# EAGLE design main (EAGLE 9.5.1)

## Sheet 1 of 5
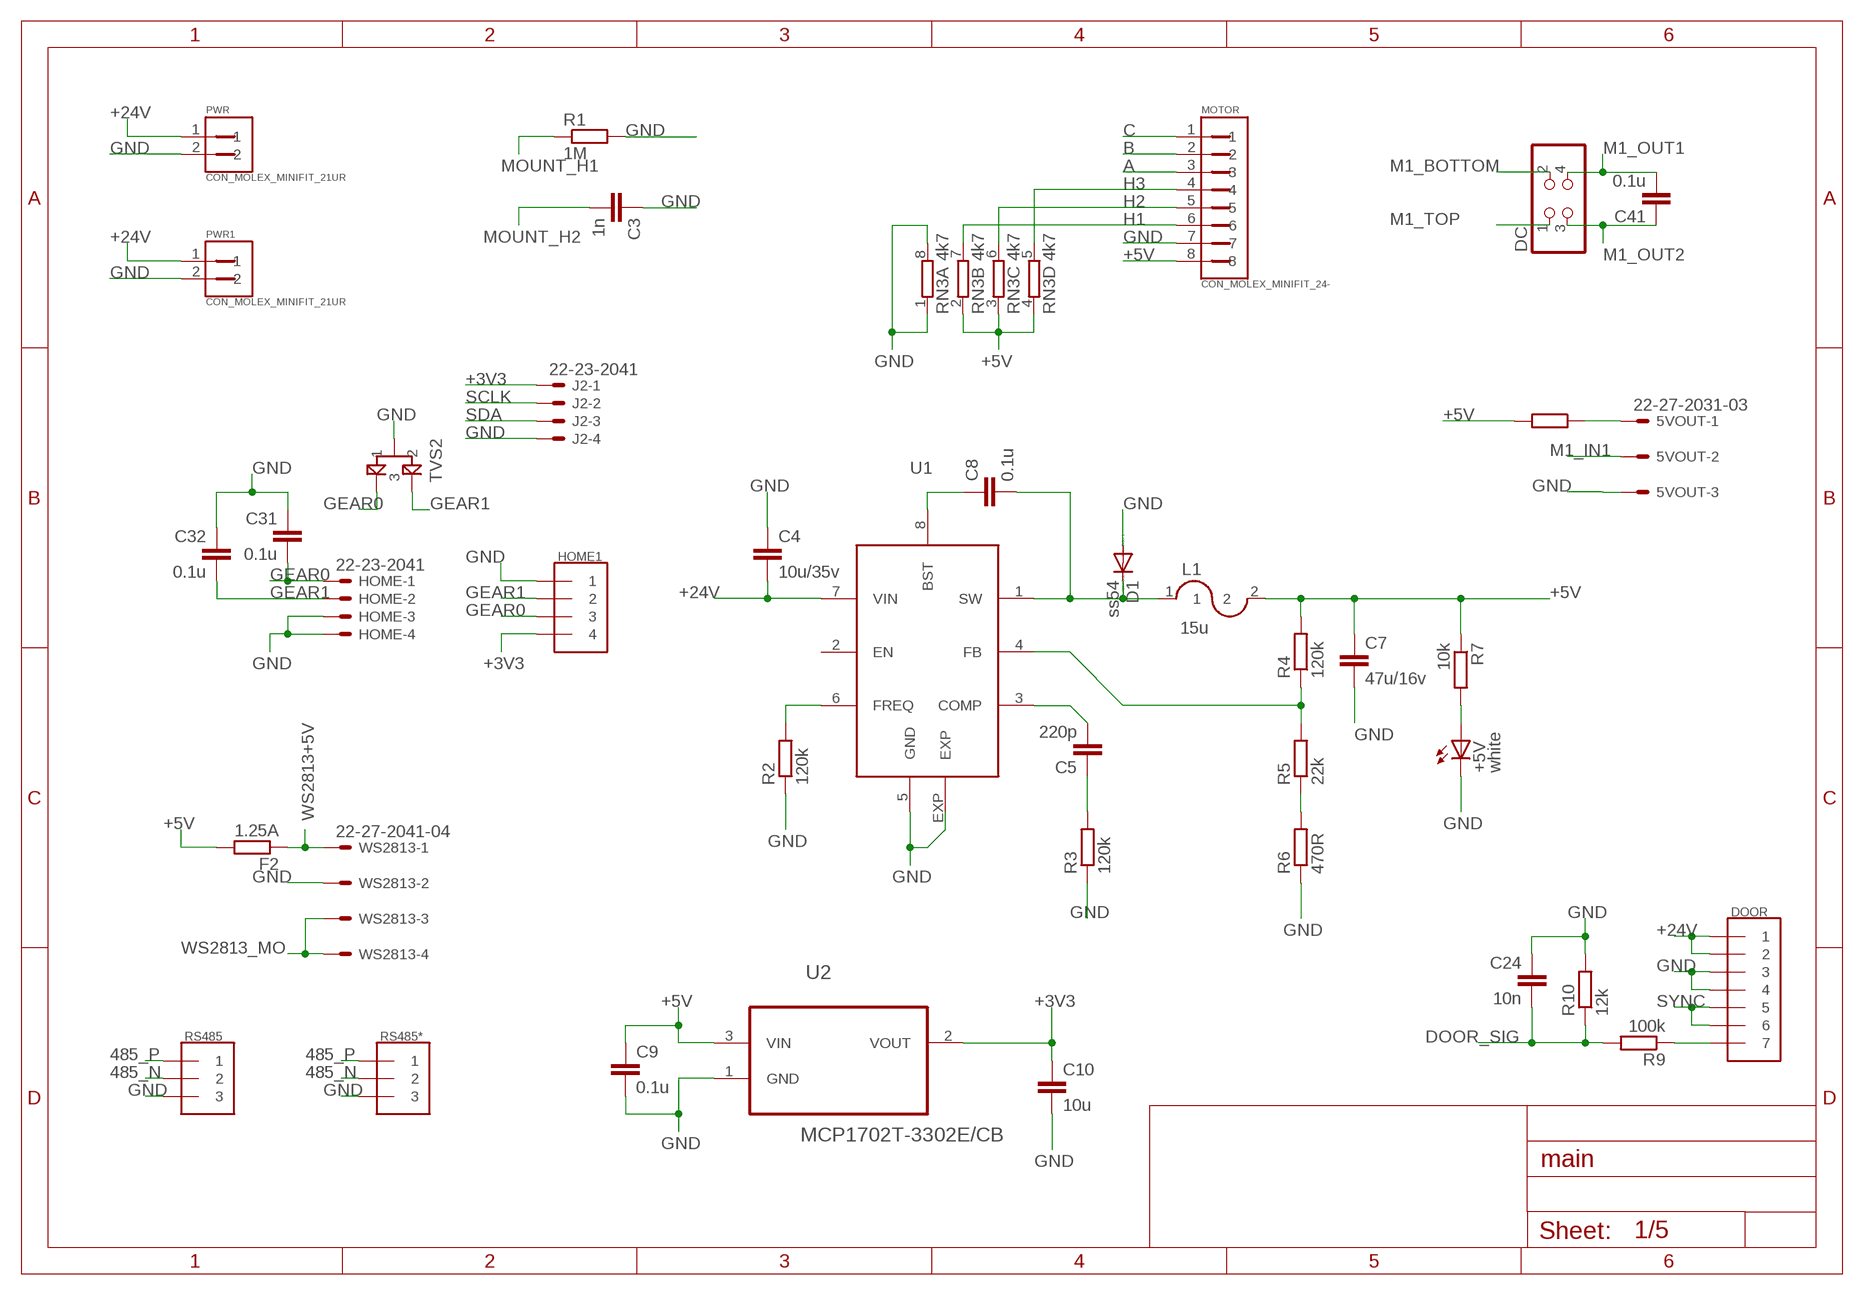
[diagram p0: schematic, sheet 1]

### Parts
5VOUT  22-27-2031-03  [6410-03]
+5V  white  LEDSML0603  [SML0603]
C3  1n  C-EUC0603  [C0603]
C4  10u/35v  C-EUC1206  [C1206]
C5  220p  C-EUC0603  [C0603]
C7  47u/16v  C-EUC1206  [C1206]
C8  0.1u  C-EUC0603  [C0603]
C9  0.1u  C-EUC0603  [C0603]
C10  10u  C-EUC0603  [C0603]
C24  10n  C-EUC0603  [C0603]
C31  0.1u  C-EUC0603  [C0603]
C32  0.1u  C-EUC0603  [C0603]
C41  0.1u  C-EUC0603  [C0603]
D1  ss54  DIODE-DO214BA  [DO214BA]
DC  430450414  [4304504-TH]
DOOR  1LINE_SOCKET_2MM_7  [1LINE_SOCKET_2MM_7]
F1  1.25A  R-EU_R1206  [R1206]
F2  1.25A  R-EU_R1206  [R1206]
HOME  22-23-2041  [22-23-2041]
HOME1  1LINE_SOCKET_2MM_4_90  [1LINE_SOCKET_2MM_4_90]
J2  22-23-2041  [22-23-2041]
L1  15u  RCL_L_CDRH8D38  [RCL_L_CDRH8D38]
MOTOR  CON_MOLEX_MINIFIT_24-  [CON_MOLEX_MINIFIT_2*4]
PWR  CON_MOLEX_MINIFIT_21UR  [CON_MOLEX_MINIFIT_2*1_UR]
PWR1  CON_MOLEX_MINIFIT_21UR  [CON_MOLEX_MINIFIT_2*1_UR]
R1  1M  R-EU_R0603  [R0603]
R2  120k  R-EU_R0603  [R0603]
R3  120k  R-EU_R0603  [R0603]
R4  120k  R-EU_R0603  [R0603]
R5  22k  R-EU_R0603  [R0603]
R6  470R  R-EU_R0603  [R0603]
R7  10k  R-EU_R0603  [R0603]
R9  100k  R-EU_R0603  [R0603]
R10  12k  R-EU_R0603  [R0603]
RN3  4k7  4R-NEXB38V  [EXB38V]
RS485  1LINE_SOCKET_2MM_3_90  [1LINE_SOCKET_2MM_3_90]
RS485*  1LINE_SOCKET_2MM_3_90  [1LINE_SOCKET_2MM_3_90]
TVS2  PESD33  GSOT05C-GS08  [RCL_SOT23]
U1  MP2560  [SOIC-8E]
U2  MCP1702T-3302E/CB  [SOT95P255X145-3N]
WS2813  22-27-2041-04  [6410-04]

### Nets
485_N: RS485*.P$2 RS485.P$2 ; also sheet 2,4
485_P: RS485*.P$1 RS485.P$1 ; also sheet 2,4
+3V3 [+3V3]: C10.1 HOME1.P$4 J2.1 U2.2(VOUT) ; also sheet 2,3
+5V: C7.1 C9.1 F1.2 F2.2 L1.2 MOTOR.8 R4.2 R7.1 RN3.2 RN3.3 RN3.4 U2.3(VIN)
+24V: C4.2 DOOR.P$1 DOOR.P$2 PWR1.1 PWR.1 U1.7(VIN) ; also sheet 3,5
A: MOTOR.3 ; also sheet 3
B: MOTOR.2 ; also sheet 3
C: MOTOR.1 ; also sheet 3
DOOR_SIG: C24.2 R9.2 R10.1 ; also sheet 2
GEAR0: C31.2 HOME1.P$3 HOME.1 TVS2.1 ; also sheet 2
GEAR1: C32.2 HOME1.P$2 HOME.2 TVS2.2 ; also sheet 2
GND: 5VOUT.3 +5V.C C3.1 C4.1 C7.2 C9.2 C10.2 C24.1 C31.1 C32.1 D1.A DOOR.P$3 DOOR.P$4 HOME1.P$1 HOME.3 HOME.4 J2.4 MOTOR.7 PWR1.2 PWR.2 R1.2 R2.1 R3.1 R6.1 R10.2 RN3.1 RN3.8 RS485*.P$3 RS485.P$3 TVS2.3 U1.5(GND) U1.EXP U2.1(GND) WS2813.2 ; also sheet 2,3,4,5
H1: MOTOR.6 RN3.7 ; also sheet 2
H2: MOTOR.5 RN3.6 ; also sheet 2
H3: MOTOR.4 RN3.5 ; also sheet 2
M1_BOTTOM: DC.2
M1_IN1: 5VOUT.2 ; also sheet 2,5
M1_OUT1: C41.2 DC.4 ; also sheet 5
M1_OUT2: C41.1 DC.3 ; also sheet 5
M1_TOP: DC.1
MOUNT_H1 [+24V]: R1.1
MOUNT_H2: C3.2
N$1: C8.2 D1.C L1.1 U1.1(SW)
N$2: 5VOUT.1 F1.1
N$3: C5.1 R3.2
N$4: R2.2 U1.6(FREQ)
N$5: C5.2 U1.3(COMP)
N$6: R5.1 R6.2
N$7: R4.1 R5.2 U1.4(FB)
N$8: C8.1 U1.8(BST)
N$9: +5V.A R7.2
SCLK: J2.2 ; also sheet 2
SDA: J2.3 ; also sheet 2
SIG-DOOR: DOOR.P$7 R9.1
SYNC: DOOR.P$5 DOOR.P$6
WS2813+5V: F2.1 WS2813.1 ; also sheet 2
WS2813_MO: WS2813.3 WS2813.4 ; also sheet 2
Unconnected: U1.2(EN)

## Sheet 2 of 5
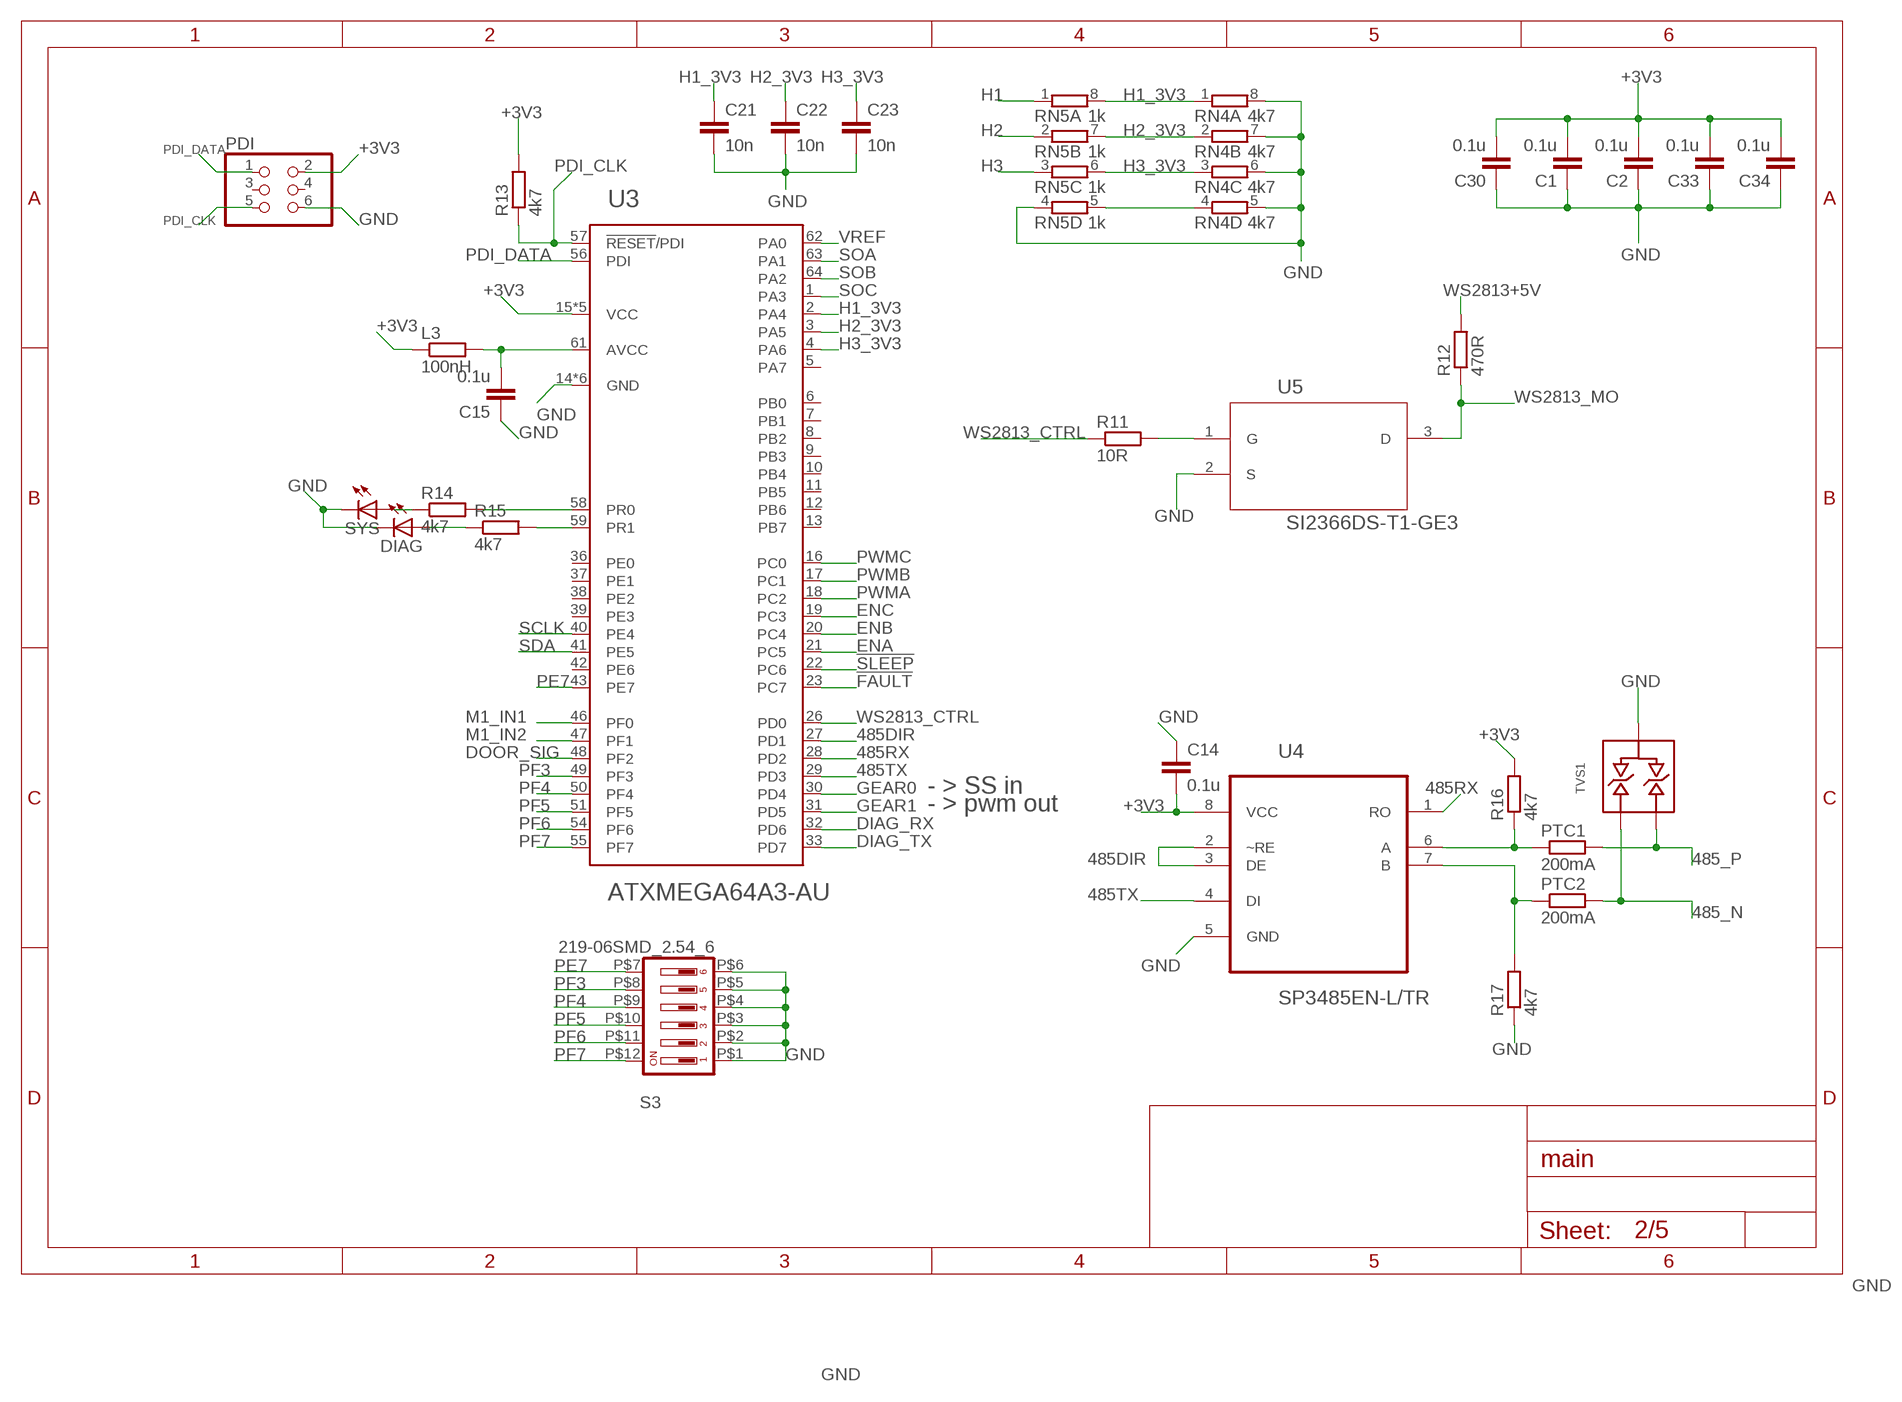
[diagram p1: schematic, sheet 2]

### Parts
C1  0.1u  C-EUC0603  [C0603]
C2  0.1u  C-EUC0603  [C0603]
C14  0.1u  C-EUC0603  [C0603]
C15  0.1u  C-EUC0603  [C0603]
C21  10n  C-EUC0603  [C0603]
C22  10n  C-EUC0603  [C0603]
C23  10n  C-EUC0603  [C0603]
C30  0.1u  C-EUC0603  [C0603]
C33  0.1u  C-EUC0603  [C0603]
C34  0.1u  C-EUC0603  [C0603]
DIAG  LEDSML0603  [SML0603]
L3  100nH  R-EU_R0603  [R0603]
PDI  PINHD-2X3  [2X03]
PTC1  200mA  R-EU_R0805  [R0805]
PTC2  200mA  R-EU_R0805  [R0805]
R11  10R  R-EU_R0603  [R0603]
R12  470R  R-EU_R0603  [R0603]
R13  4k7  R-EU_R0603  [R0603]
R14  4k7  R-EU_R0603  [R0603]
R15  4k7  R-EU_R0603  [R0603]
R16  4k7  R-EU_R0603  [R0603]
R17  4k7  R-EU_R0603  [R0603]
RN4  4k7  4R-NEXB38V  [EXB38V]
RN5  1k  4R-NEXB38V  [EXB38V]
S3  219-06SMD_2.54_6  [SMD-2.54-6]
SYS  LEDSML0603  [SML0603]
TVS1  SM712  [SOT23]
U3  ATXMEGA64A3-AU  [TQFP-64A-64]
U4  SP3485EN-L/TR  MAX3485CSA+  [SOIC127P600X175-8N]
U5  SI2366DS-T1-GE3  [SOT95P237X112-3N]

### Nets
485_N: PTC2.2 TVS1.P$1 ; also sheet 1,4
485_P: PTC1.2 TVS1.P$2 ; also sheet 1,4
485DIR: U3.27(PD1) U4.2(~RE) U4.3(DE)
485RX: U3.28(PD2) U4.1(RO)
485TX: U3.29(PD3) U4.4(DI)
!FAULT: U3.23(PC7) ; also sheet 3
!SLEEP: U3.22(PC6) ; also sheet 3
+3V3 [+3V3]: C1.2 C2.2 C14.2 C30.2 C33.2 C34.2 L3.1 PDI.2 R13.2 R16.2 U3.15(VCC) U3.25(VCC) U3.35(VCC) U3.45(VCC) U3.53(VCC) U4.8(VCC) ; also sheet 1,3
DIAG_RX: U3.32(PD6)
DIAG_TX: U3.33(PD7)
DOOR_SIG: U3.48(PF2) ; also sheet 1
ENA: U3.21(PC5) ; also sheet 3
ENB: U3.20(PC4) ; also sheet 3
ENC: U3.19(PC3) ; also sheet 3
GEAR0: U3.30(PD4) ; also sheet 1
GEAR1: U3.31(PD5) ; also sheet 1
GND: C1.1 C2.1 C14.1 C15.1 C21.2 C22.2 C23.2 C30.1 C33.1 C34.1 DIAG.C PDI.6 R17.1 RN4.4 RN4.5 RN4.6 RN4.7 RN4.8 RN5.4 RN5.5 S3.P$1 S3.P$2 S3.P$3 S3.P$4 S3.P$5 S3.P$6 SYS.C TVS1.P$3 U3.14(GND) U3.24(GND) U3.34(GND) U3.44(GND) U3.52(GND) U3.60(GND) U4.5(GND) U5.2(S) ; also sheet 1,3,4,5
H1: RN5.1 ; also sheet 1
H1_3V3: C21.1 RN4.1 RN5.8 U3.2(PA4)
H2: RN5.2 ; also sheet 1
H2_3V3: C22.1 RN4.2 RN5.7 U3.3(PA5)
H3: RN5.3 ; also sheet 1
H3_3V3: C23.1 RN4.3 RN5.6 U3.4(PA6)
M1_IN1: U3.46(PF0) ; also sheet 1,5
M1_IN2: U3.47(PF1) ; also sheet 5
N$10: PTC2.1 R17.2 U4.7(B)
N$17: PTC1.1 R16.1 U4.6(A)
N$19: C15.2 L3.2 U3.61(AVCC)
N$20: R14.2 U3.58(PR0)
N$21: R14.1 SYS.A
N$22: R15.2 U3.59(PR1)
N$23: DIAG.A R15.1
N$53: R11.2 U5.1(G)
PDI_CLK: PDI.5 R13.1 U3.57(!RESET!/PDI)
PDI_DATA: PDI.1 U3.56(PDI)
PE7: S3.P$7 U3.43(PE7)
PF3: S3.P$8 U3.49(PF3)
PF4: S3.P$9 U3.50(PF4)
PF5: S3.P$10 U3.51(PF5)
PF6: S3.P$11 U3.54(PF6)
PF7: S3.P$12 U3.55(PF7)
PWMA: U3.18(PC2) ; also sheet 3
PWMB: U3.17(PC1) ; also sheet 3
PWMC: U3.16(PC0) ; also sheet 3
SCLK: U3.40(PE4) ; also sheet 1
SDA: U3.41(PE5) ; also sheet 1
SOA: U3.63(PA1) ; also sheet 3
SOB: U3.64(PA2) ; also sheet 3
SOC: U3.1(PA3) ; also sheet 3
VREF: U3.62(PA0) ; also sheet 3
WS2813+5V: R12.2 ; also sheet 1
WS2813_CTRL: R11.1 U3.26(PD0)
WS2813_MO: R12.1 U5.3(D) ; also sheet 1
Unconnected: PDI.3 PDI.4 U3.5(PA7) U3.6(PB0) U3.7(PB1) U3.8(PB2) U3.9(PB3) U3.10(PB4) U3.11(PB5) U3.12(PB6) U3.13(PB7) U3.36(PE0) U3.37(PE1) U3.38(PE2) U3.39(PE3) U3.42(PE6)

### Notes on the sheet
- - > SS in
- - > pwm out

## Sheet 3 of 5
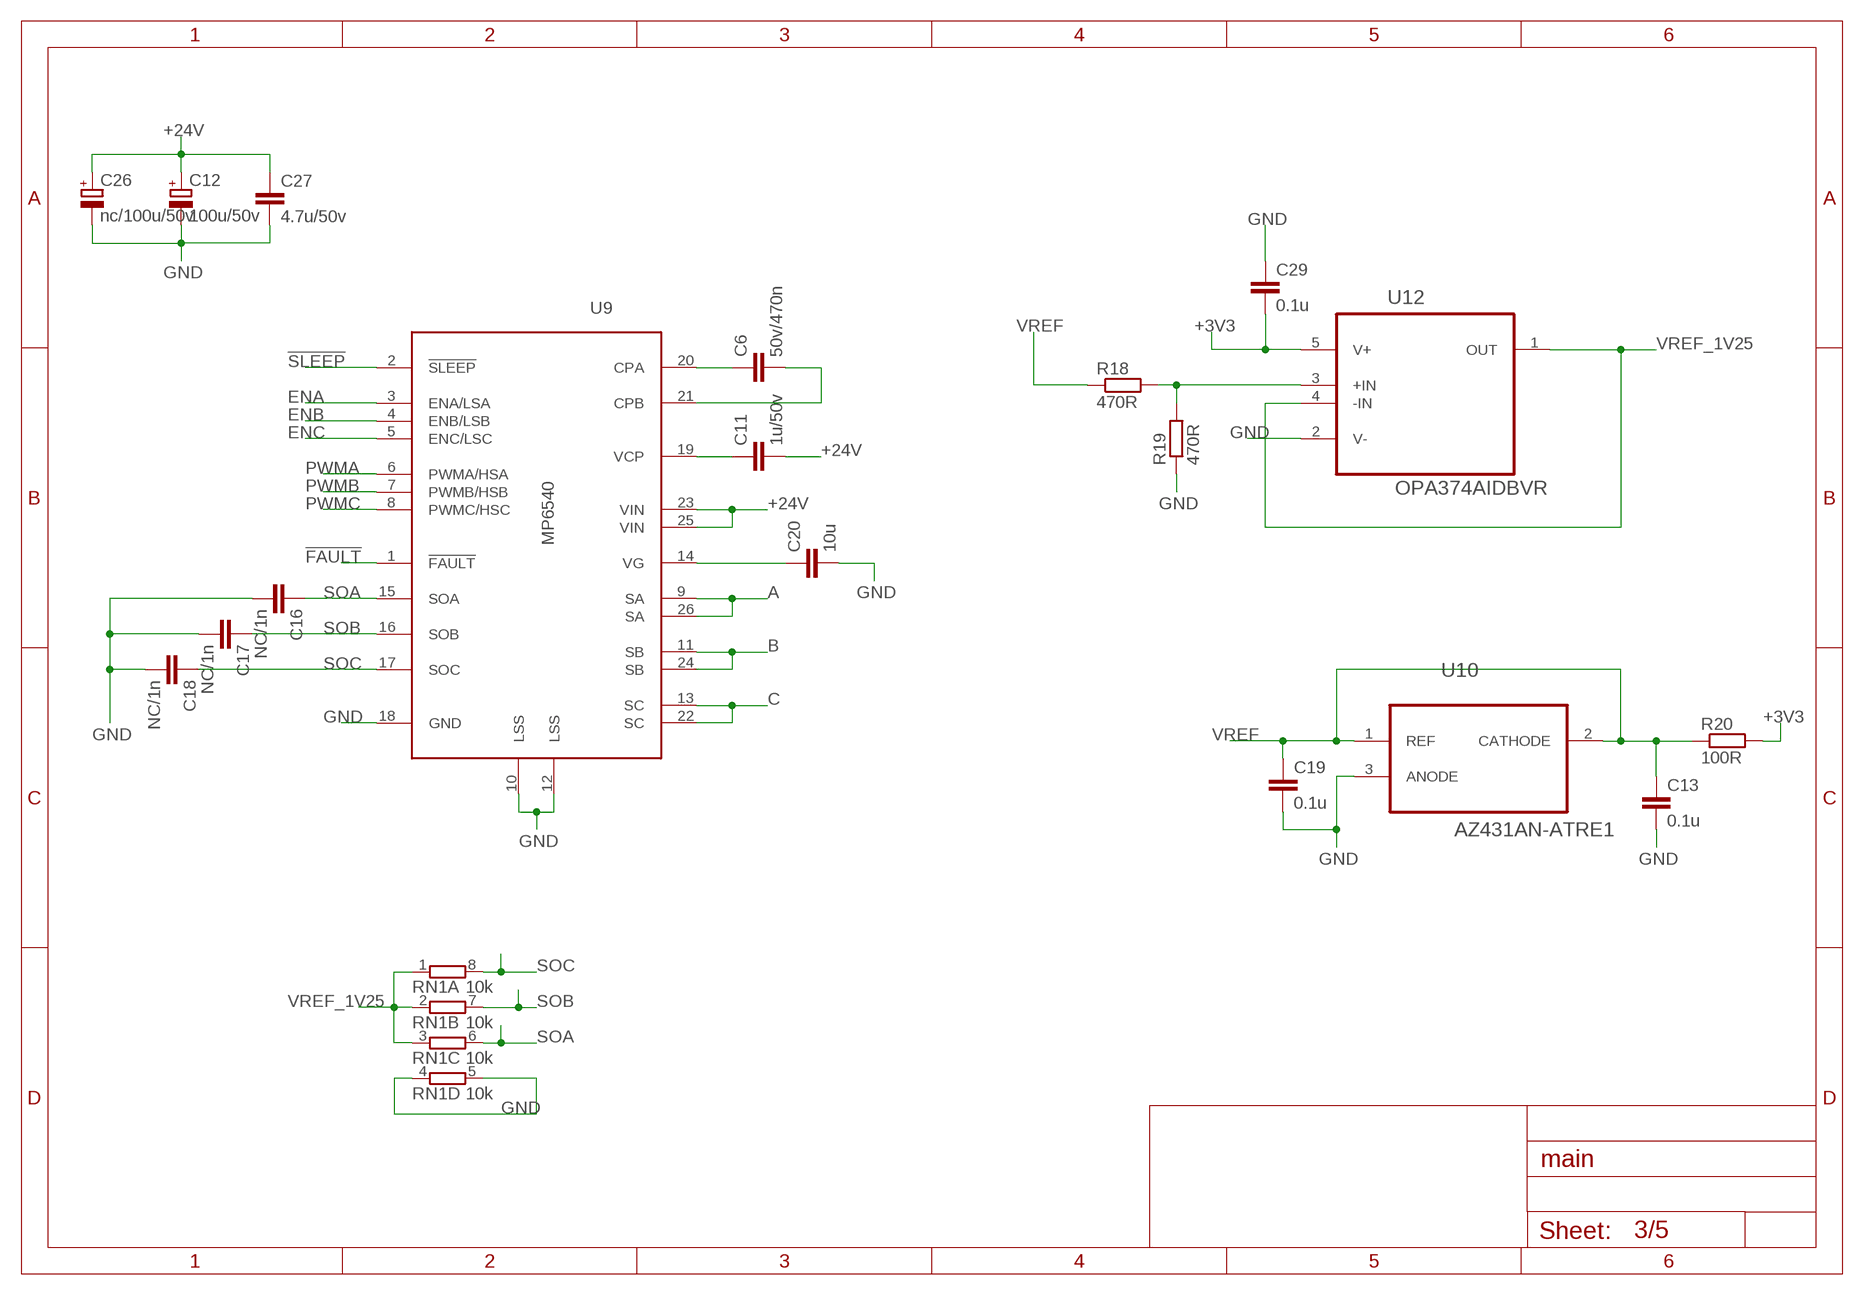
[diagram p2: schematic, sheet 3]

### Parts
C6  50v/470n  C-EUC0603  [C0603]
C11  1u/50v  C-EUC0805  [C0805]
C12  100u/50v  CPOL-EU140CLH-0810  [140CLH-0810]
C13  0.1u  C-EUC0603  [C0603]
C16  NC/1n  C-EUC0603  [C0603]
C17  NC/1n  C-EUC0603  [C0603]
C18  NC/1n  C-EUC0603  [C0603]
C19  0.1u  C-EUC0603  [C0603]
C20  10u  C-EUC0603  [C0603]
C26  nc/100u/50v  CPOL-EU140CLH-0810  [140CLH-0810]
C27  4.7u/50v  C-EUC0805  [C0805]
C29  0.1u  C-EUC0603  [C0603]
R18  470R  R-EU_R0603  [R0603]
R19  470R  R-EU_R0603  [R0603]
R20  100R  R-EU_R0603  [R0603]
RN1  10k  4R-NEXB38V  [EXB38V]
U9  MP6540  [QFN-26]
U10  AZ431AN-ATRE1  TL431BQDBZR  [SOT95P237X112-3N]
U12  OPA374AIDBVR  OPA378AIDBVT  [SOT95P280X145-5N]

### Nets
!FAULT: U9.1(!FAULT) ; also sheet 2
!SLEEP: U9.2(!SLEEP) ; also sheet 2
+3V3 [+3V3]: C29.2 R20.2 U12.5(V+) ; also sheet 1,2
+24V: C11.2 C12.+ C26.+ C27.1 U9.23(VIN) U9.25(VIN) ; also sheet 1,5
A: U9.9(SA) U9.26(SA) ; also sheet 1
B: U9.11(SB) U9.24(SB) ; also sheet 1
C: U9.13(SC) U9.22(SC) ; also sheet 1
ENA: U9.3(ENA/LSA) ; also sheet 2
ENB: U9.4(ENB/LSB) ; also sheet 2
ENC: U9.5(ENC/LSC) ; also sheet 2
GND: C12.- C13.2 C16.2 C17.2 C18.2 C19.2 C20.2 C26.- C27.2 C29.1 R19.1 RN1.4 RN1.5 U9.10(LSS) U9.12(LSS) U9.18(GND) U10.3(ANODE) U12.2(V-) ; also sheet 1,2,4,5
N$11: R18.2 R19.2 U12.3(+IN)
N$12: C6.1 U9.20(CPA)
N$13: C6.2 U9.21(CPB)
N$14: C11.1 U9.19(VCP)
N$15: C20.1 U9.14(VG)
PWMA: U9.6(PWMA/HSA) ; also sheet 2
PWMB: U9.7(PWMB/HSB) ; also sheet 2
PWMC: U9.8(PWMC/HSC) ; also sheet 2
SOA: C16.1 RN1.6 U9.15(SOA) ; also sheet 2
SOB: C17.1 RN1.7 U9.16(SOB) ; also sheet 2
SOC: C18.1 RN1.8 U9.17(SOC) ; also sheet 2
VREF: C13.1 C19.1 R18.1 R20.1 U10.1(REF) U10.2(CATHODE) ; also sheet 2
VREF_1V25: RN1.1 RN1.2 RN1.3 U12.1(OUT) U12.4(-IN)

## Sheet 4 of 5
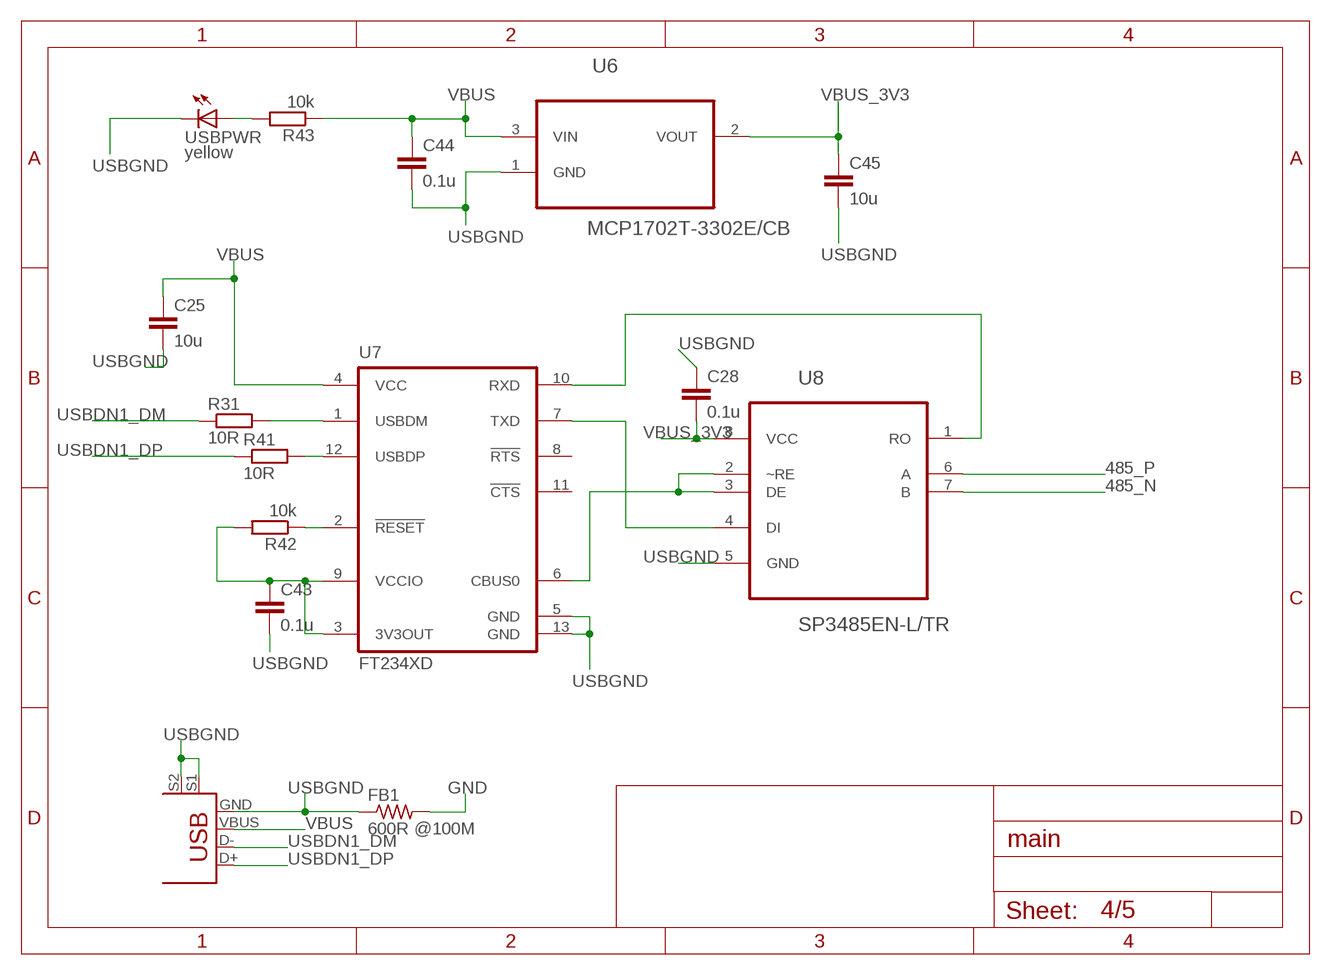
[diagram p3: schematic, sheet 4]

### Parts
C25  10u  C-EUC0603  [C0603]
C28  0.1u  C-EUC0603  [C0603]
C43  0.1u  C-EUC0603  [C0603]
C44  0.1u  C-EUC0603  [C0603]
C45  10u  C-EUC0603  [C0603]
FB1  600R @100M  R-US_R0805  [R0805]
R31  10R  R-EU_R0603  [R0603]
R41  10R  R-EU_R0603  [R0603]
R42  10k  R-EU_R0603  [R0603]
R43  10k  R-EU_R0603  [R0603]
U6  MCP1702T-3302E/CB  [SOT95P255X145-3N]
U7  FT234XD  [DFN12]
U8  SP3485EN-L/TR  MAX3485CSA+  [SOIC127P600X175-8N]
USBPWR  yellow  LEDSML0603  [SML0603]
USBUP  USB+SHIELD  [USB-B-PTH]

### Nets
485_N: U8.7(B) ; also sheet 1,2
485_P: U8.6(A) ; also sheet 1,2
GND: FB1.2 ; also sheet 1,2,3,5
N$39: R31.2 U7.1(USBDM)
N$60: R41.2 U7.12(USBDP)
N$63: C43.1 R42.2 U7.3(3V3OUT) U7.9(VCCIO)
N$64: R42.1 U7.2(!RESET!)
N$65: U7.7(TXD) U8.4(DI)
N$66: U7.10(RXD) U8.1(RO)
N$67: U7.6(CBUS0) U8.2(~RE) U8.3(DE)
N$68: R43.2 USBPWR.A
USBDN1_DM: R31.1 USBUP.D-
USBDN1_DP: R41.1 USBUP.D+
USBGND: C25.2 C28.1 C43.2 C44.2 C45.2 FB1.1 U6.1(GND) U7.5(GND) U7.13(GND) U8.5(GND) USBPWR.C USBUP.GND USBUP.S1 USBUP.S2
VBUS: C25.1 C44.1 R43.1 U6.3(VIN) U7.4(VCC) USBUP.VBUS
VBUS_3V3 [+3V3]: C28.2 C45.1 U6.2(VOUT) U8.8(VCC)
Unconnected: U7.8(!RTS!) U7.11(!CTS!)

## Sheet 5 of 5
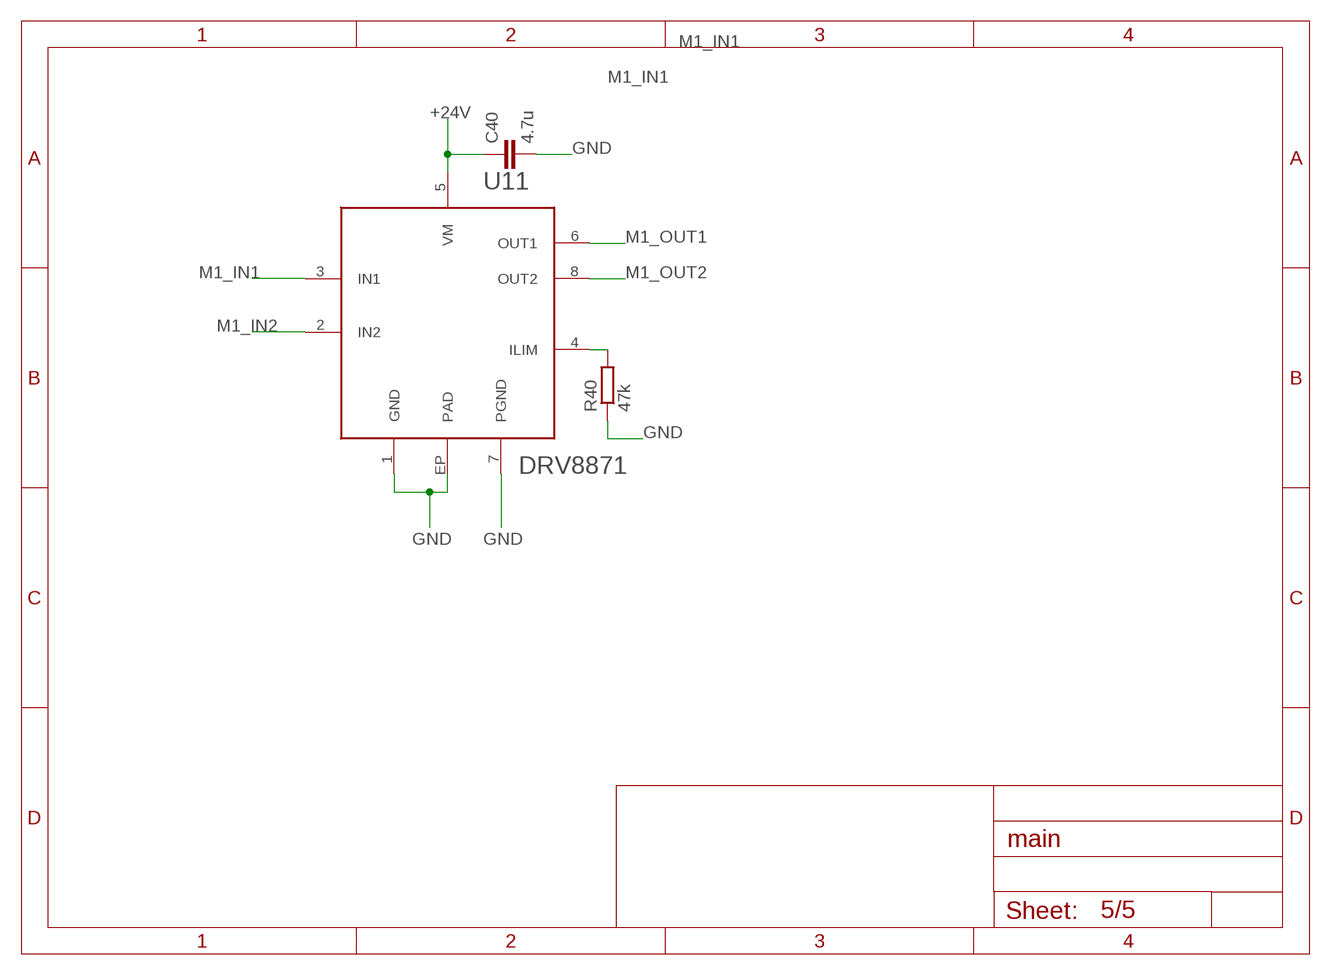
[diagram p4: schematic, sheet 5]

### Parts
C40  4.7u  C-EUC0805  [C0805]
R40  47k  R-EU_R0603  [R0603]
U11  DRV8871  [8HSOIC]

### Nets
+24V: C40.1 U11.5(VM) ; also sheet 1,3
GND: C40.2 R40.1 U11.1(GND) U11.7(PGND) U11.EP(PAD) ; also sheet 1,2,3,4
M1_IN1: U11.3(IN1) ; also sheet 1,2
M1_IN2: U11.2(IN2) ; also sheet 2
M1_OUT1: U11.6(OUT1) ; also sheet 1
M1_OUT2: U11.8(OUT2) ; also sheet 1
N$62: R40.2 U11.4(ILIM)

## Library data of the parts
5VOUT = con-molex:22-?-03: CONNECTOR wire to board 2.54 mm (.1 inch) pitch header; OC_FARNELL: unknown; OC_NEWARK: unknown
+5V DIAG SYS USBPWR = led:LED: LED OSRAM: - CHIPLED LG R971, LG N971, LY N971, LG Q971, LY Q971, LO R971, LY R971 LH N974, LH R974 LS Q976, LO Q976, LY Q976 LO Q996 - Hyper CHIPLED LW Q18S LB Q993, LB Q99A, LB R99A - SideLED LS A670, LO A670, LY A670, LG A670, LP A670 LB A673, LV A673, LT A673, LW A673 LH A674 LY A675 LS A676, LA A676, LO A676, LY A676, LW A676 LS A679, LY A679, LG A679 - Hyper Micro SIDELED® LS Y876, LA Y876, LO Y876, LY Y876 LT Y87S - SmartLED LW L88C, LW L88S LB L89C, LB L89S, LG L890 LS L89K, LO L89K, LY L89K LS L896, LA L896, LO L896, LY L896 - TOPLED LS T670, LO T670, LY T670, LG T670, LP T670 LSG T670, LSP T670, LSY T670, LOP T670, LYG T670 LG T671, LOG T671, LSG T671 LB T673, LV T673, LT T673, LW T673 LH T674 LS T676, LA T676, LO T676, LY T676, LB T676, LH T676, LSB T676, LW T676 LB T67C, LV T67C, LT T67C, LS T67K, LO T67K, LY T67K, LW E67C LS E67B, LA E67B, LO E67B, LY E67B, LB E67C, LV E67C, LT E67C LW T67C LS T679, LY T679, LG T679 LS T770, LO T770, LY T770, LG T770, LP T770 LB T773, LV T773, LT T773, LW T773 LH T774 LS E675, LA E675, LY E675, LS T675 LS T776, LA T776, LO T776, LY T776, LB T776 LHGB T686 LT T68C, LB T68C - Hyper Mini TOPLED® LB M676 - Mini TOPLED Santana® LG M470 LS M47K, LO M47K, LY M47K Source: http://www.osram.convergy.de LUXEON: - LUMILED® LXK2-PW12-R00, LXK2-PW12-S00, LXK2-PW14-U00, LXK2-PW14-V00 LXK2-PM12-R00, LXK2-PM12-S00, LXK2-PM14-U00 LXK2-PE12-Q00, LXK2-PE12-R00, LXK2-PE12-S00, LXK2-PE14-T00, LXK2-PE14-U00 LXK2-PB12-K00, LXK2-PB12-L00, LXK2-PB12-M00, LXK2-PB14-N00, LXK2-PB14-P00, LXK2-PB14-Q00 LXK2-PR12-L00, LXK2-PR12-M00, LXK2-PR14-Q00, LXK2-PR14-R00 LXK2-PD12-Q00, LXK2-PD12-R00, LXK2-PD12-S00 LXK2-PH12-R00, LXK2-PH12-S00 LXK2-PL12-P00, LXK2-PL12-Q00, LXK2-PL12-R00 Source: www.luxeon.com KINGBRIGHT: KA-3528ASYC Source: www.kingbright.com
C1-C11 C13-C25 C27-C34 C40 C41 C43-C45 = rcl:C-EU: CAPACITOR, European symbol
C12 C26 = rcl:CPOL-EU: POLARIZED CAPACITOR, European symbol
D1 = diode:DIODE-: DIODE
DC = con-molex-43045:4304504: 4-pin Male Molex Connector Temp range -40 to 105 C Current rating 5A per conductor Voltage rating 250V
DOOR = my_con:1LINE_SOCKET_2MM_7
F1 F2 L3 PTC1 PTC2 R1-R7 R9-R20 R31 R40-R43 = rcl:R-EU_: RESISTOR, European symbol
FB1 = rcl:R-US_: RESISTOR, American symbol
HOME J2 = con-molex:22-23-2041: .100" (2.54mm) Center Header - 4 Pin; MF: MOLEX; MPN: 22-23-2041; OC_FARNELL: 1462920; OC_NEWARK: 38C0355
HOME1 = my_con:1LINE_SOCKET_2MM_4_90
L1 = my_rcl:RCL_L_CDRH8D38: http://products.sumida.com/products/pdf/CDRH8D38.pdf
MOTOR = my_con:CON_MOLEX_MINIFIT_2*4
PDI = pinhead:PINHD-2X3: PIN HEADER
PWR PWR1 = my_con:CON_MOLEX_MINIFIT_2*1
RN1 RN3-RN5 = resistor-dil:4R-N: Array Chip Resistor Source: RS Component / Phycomp; OC_FARNELL: unknown; OC_NEWARK: unknown
RS485 RS485* = my_con:1LINE_SOCKET_2MM_3_90
S3 = SWITCH_DIR_1.27_10:219-06*: Surface Mount DIP Switch Series 219 SMT CTS Electronic Components Sourc: www.ctscorp.com
TVS1 = my_ic:SM712
TVS2 = my_rcl:GSOT05C-GS08
U1 = my_ic:MP2560
U2 U6 = Microchip_By_element14_Batch_1:MCP1702T-3302E/CB: 250 mA Low Quiescent Current LDO Regulator; MPN: MCP1702T-3302E/CB; OC_FARNELL: 1331490; OC_NEWARK: 84R5179; PACKAGE: SOT23-3; SUPPLIER: Microchip
U3 = atmel-xmega:ATXMEGA64A3: 8/16-bit XMEGA A3 Microcontroller Features High-performance, Low-power 8/16-bit Atmel® AVR® XMEGATM Microcontroller Non-volatile Program and Data Memories – 64 KB - 256 KB of In-System Self-Programmable Flash – 4 KB - 8 KB Boot Code Section with Independent Lock Bits – 2 KB - 4 KB EEPROM – 4 KB - 16 KB Internal SRAM Peripheral Features – Four-channel DMA Controller with support for external requests – Eight-channel Event System – Seven 16-bit Timer/Counters Four Timer/Counters with 4 Output Compare or Input Capture channels Three Timer/Counters with 2 Output Compare or Input Capture channels High Resolution Extensions on all Timer/Counters Advanced Waveform Extension on one Timer/Counter – Seven USARTs IrDA Extension on 1 USART – AES and DES Crypto Engine – Two Two-wire Interfaces with dual address match (I2C and SMBus compatible) – Three SPI (Serial Peripheral Interfaces) – 16-bit Real Time Counter with Separate Oscillator – Two Eight-channel, 12-bit, 2 Msps Analog to Digital Converters – One Two-channel, 12-bit, 1 Msps Digital to Analog Converter – Four Analog Comparators with Window compare function – External Interrupts on all General Purpose I/O pins – Programmable Watchdog Timer with Separate On-chip Ultra Low Power Oscillator Special Microcontroller Features – Power-on Reset and Programmable Brown-out Detection – Internal and External Clock Options with PLL – Programmable Multi-level Interrupt Controller – Sleep Modes: Idle, Power-down, Standby, Power-save, Extended Standby – Advanced Programming, Test and Debugging Interfaces JTAG (IEEE 1149.1 Compliant) Interface for test, debug and programming PDI (Program and Debug Interface) for programming, test and debugging I/O and Packages – 50 Programmable I/O Lines – 64-lead TQFP – 64-pad QFN Operating Voltage – 1.6 – 3.6V Speed performance – 0 – 12 MHz @ 1.6 – 3.6V – 0 – 32 MHz @ 2.7 – 3.6V
U4 U8 = Maxim_By_element14_Batch_1:MAX3485CSA+: 3.3V-Powered, 10Mbps and Slew-Rate-Limited True RS-485/RS-422 Transceivers; MPN: MAX3485CSA+; OC_FARNELL: 1379946; OC_NEWARK: 68K4659; PACKAGE: SOIC-8; SUPPLIER: Maxim
U5 = Vishay_By_element14_Batch_1:SI2366DS-T1-GE3: N-Channel 30 V (D-S) MOSFET; MPN: SI2366DS-T1-GE3; OC_FARNELL: 2056680; OC_NEWARK: 64T4057; PACKAGE: SOT-23-3; SUPPLIER: VISHAY SILICONIX
U7 = ftdi-chip:FT234XD: USB TO BASIC UART IC
U9 = my_ic:MP6540
U10 = Texas Instruments_By_element14_Batch_1:TL431BQDBZR: PRECISION PROGRAMMABLE REFERENCE; MPN: TL431BQDBZR; OC_FARNELL: 1764815; OC_NEWARK: 44J2402; PACKAGE: SOT23-3; SUPPLIER: Texas Instruments
U11 = my_ic:DRV8871
U12 = Texas Instruments_By_element14_Batch_1:OPA378AIDBVT: Low-Noise, 900kHz, RRIO Precision OPERATIONAL AMPLIFIER Zerø-Drift Series; MPN: OPA378AIDBVT; OC_FARNELL: 1735565; OC_NEWARK: 14R7884; PACKAGE: SOT-23-5; SUPPLIER: Texas Instruments
USBUP = SparkFun-Connectors:USB+SHIELD: USB+Shield USB connector with shield pins connectable
WS2813 = con-molex:22-?-04: CONNECTOR wire to board 2.54 mm (.1 inch) pitch header; OC_FARNELL: unknown; OC_NEWARK: unknown

## Net classes
1 +24V: width 0.254 mm, drill 0.127 mm, clearance 0.254 mm

## Board
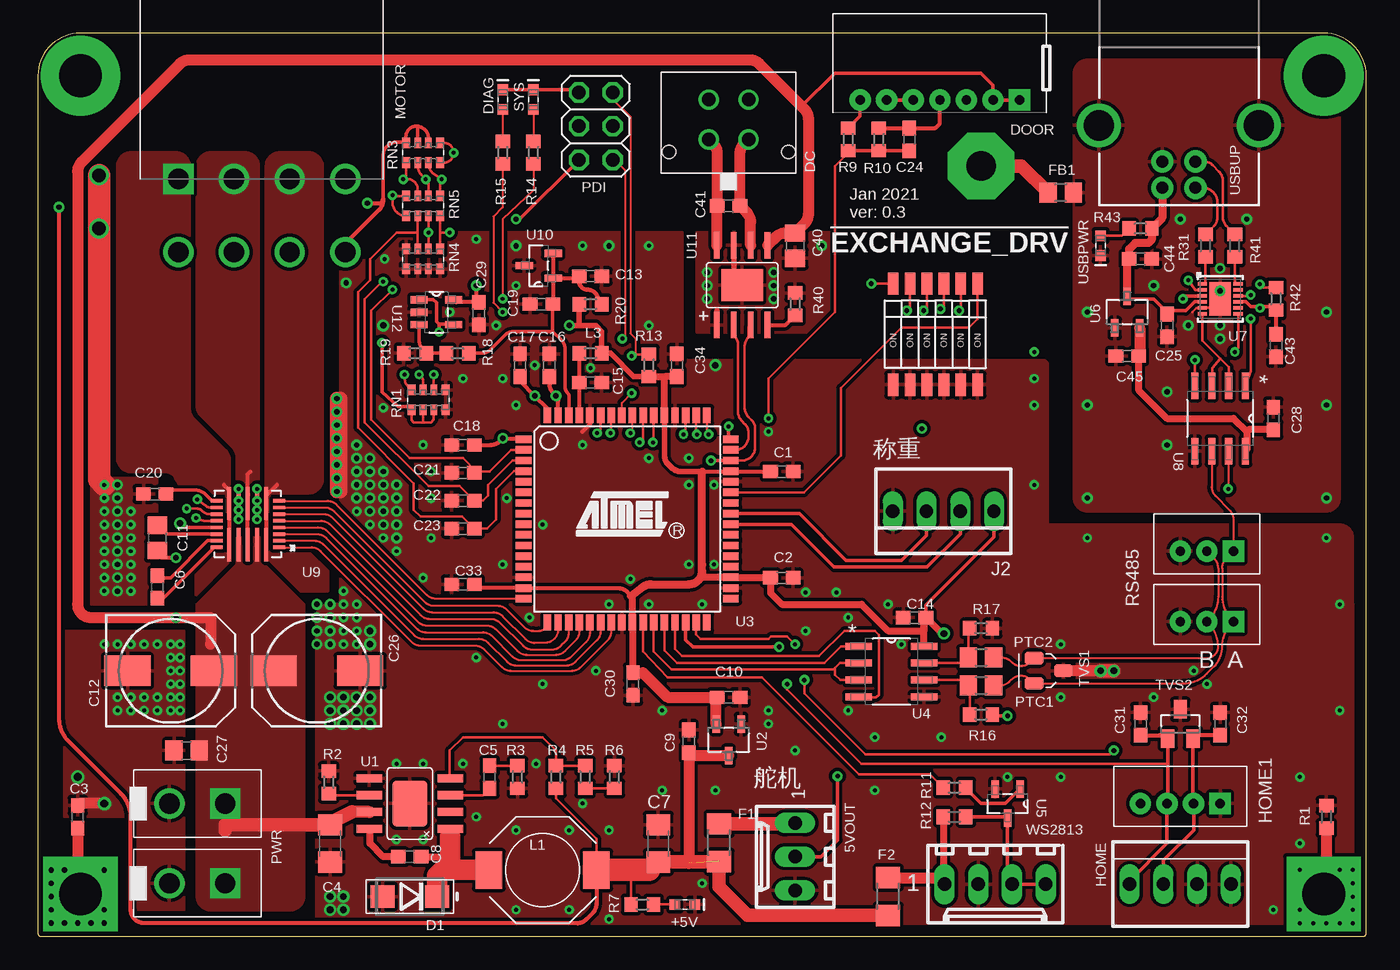
[diagram p5: board, top side]
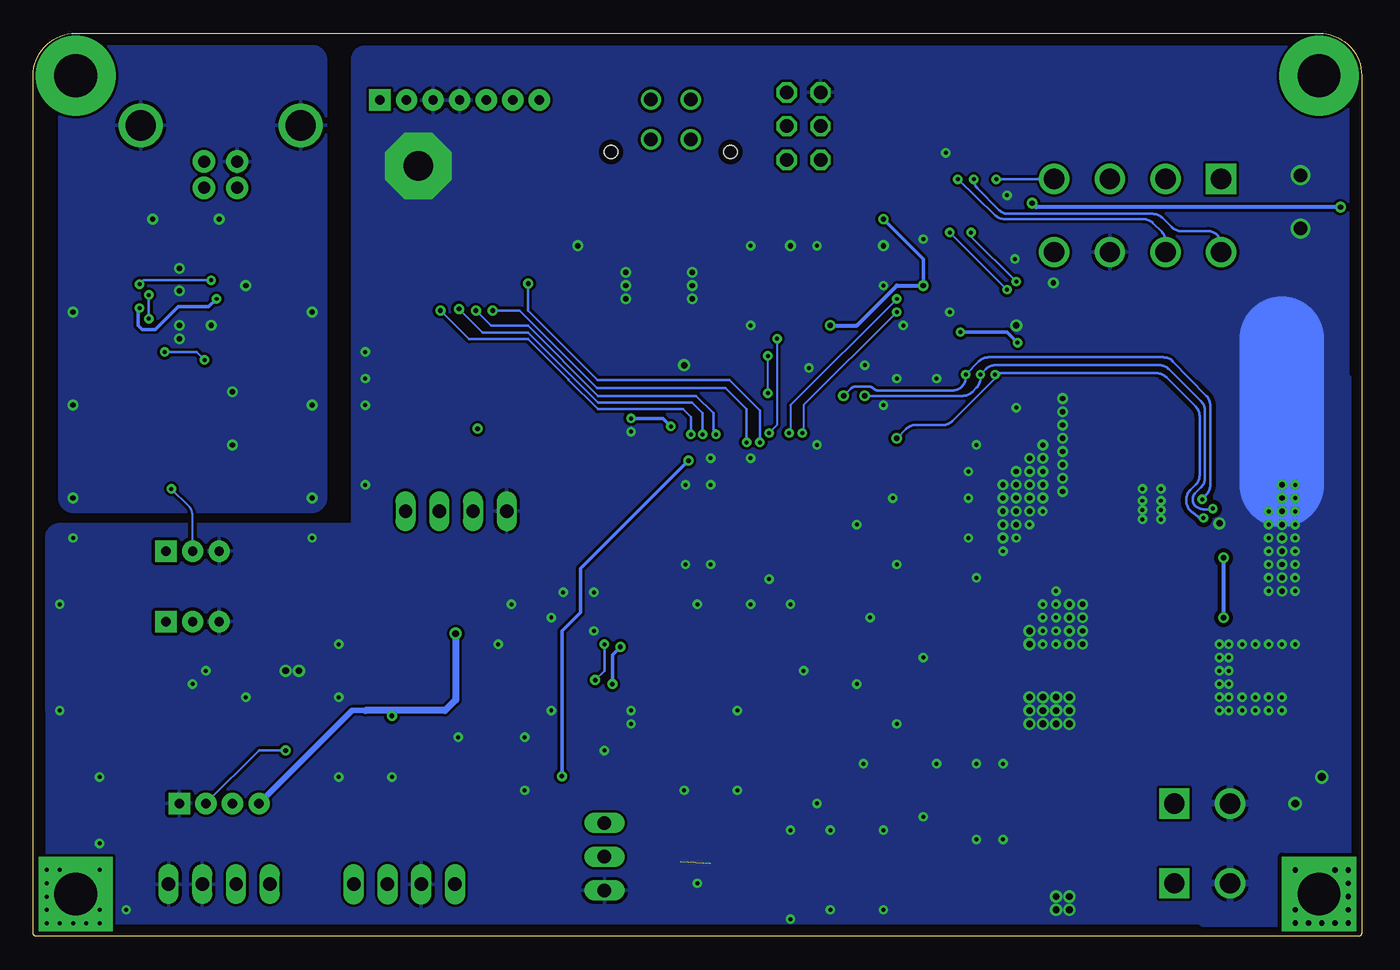
[diagram p6: board, bottom side, seen from below]

Size 100 x 68 mm. Coordinates in mm from the lower left corner, seen from the top.
Outline: 0,64.8 0,0.25 arc90 0.25,0 99.75,0 arc90 100,0.25 100,64.8 arc90 96.8,68 3.2,68 arc90 0,64.8
Copper layers (1*16): Top 0.035mm / dielectric 1.5mm / Bottom 0.035mm
Design rules "default *": minimum track width 6mil, minimum drill 0.3mm, track to track 6mil, track to pad 6mil, pad to pad 6mil, via to via 6mil, smd to smd 5mil, copper to edge 0.4mm, drill to drill 8mil, minimum pad ring 8mil, minimum via ring 8mil, stop-mask expansion 4mil, vias tented up to drill 1mm, thermal gap 10mil

### Footprints (pad centres in the part's own frame; a part is rotated, then mirrored left to right if it is on the bottom)
6410-03 = drill 1.016 long: 1 2.54,0; 2 0,0; 3 -2.54,0
SML0603 = smd 0.8 x 0.8: A 0.75,0; C -0.75,0
C0603 = smd 1.1 x 1: 1 -0.85,0; 2 0.85,0
C1206 = smd 1.6 x 1.8: 1 -1.4,0; 2 1.4,0
C0805 = smd 1.3 x 1.5: 1 -0.95,0; 2 0.95,0
140CLH-0810 = smd 3.48 x 2.286: + 3.25,0; - -3.25,0
DO214BA = smd 1.8 x 1.7: A 2.05,0; C -2.05,0
4304504-TH = drill 1.016: 1 1.499,-2.997; 2 -1.499,-2.997; 3 1.499,0; 4 -1.499,0 | hole 1.016: -4.496,0.94; 4.496,0.94
1LINE_SOCKET_2MM_7 = drill 0.7 pad 1.6 square: P$1 -6,0.96 | drill 0.7 pad 1.6: P$2 -4,0.96; P$3 -2,0.96; P$4 0,0.96; P$5 2,0.96; P$6 4,0.96; P$7 6,0.96
R1206 = smd 1.6 x 1.803: 1 -1.422,0; 2 1.422,0
R0805 = smd 1.3 x 1.5: 1 -0.95,0; 2 0.95,0
22-23-2041 = drill 1 long: 1 -3.81,0; 2 -1.27,0; 3 1.27,0; 4 3.81,0
1LINE_SOCKET_2MM_4_90 = drill 0.7 pad 1.6 square: P$1 3,0 | drill 0.7 pad 1.6: P$2 1,0; P$3 -1,0; P$4 -3,0
RCL_L_CDRH8D38 = smd 2 x 2.8: 1 -4.05,0; 2 4.05,0
R0603 = smd 1 x 1.1: 1 -0.85,0; 2 0.85,0
CON_MOLEX_MINIFIT_2*4 = drill 1.524 square: 1 6.287,0 | drill 1.524: 2 2.095,0; 3 -2.095,0; 4 -6.287,0; 5 6.287,5.512; 6 2.095,5.512; 7 -2.095,5.512; 8 -6.287,5.512
2X03 = drill 1.016 octagon: 1 -2.54,-1.27; 2 -2.54,1.27; 3 0,-1.27; 4 0,1.27; 5 2.54,-1.27; 6 2.54,1.27
CON_MOLEX_MINIFIT_2*1_UR = drill 1.524 square: 1 0,-2.1 | drill 1.524: 2 0,2.1
EXB38V = smd 0.6 x 0.8: 1 -1.275,-0.75; 4 1.275,-0.75; 5 1.275,0.75; 8 -1.275,0.75 | smd 0.5 x 0.8: 2 -0.4,-0.75; 3 0.4,-0.75; 6 0.4,0.75; 7 -0.4,0.75
1LINE_SOCKET_2MM_3_90 = drill 0.7 pad 1.6 square: P$1 2,0 | drill 0.7 pad 1.6: P$2 0,0; P$3 -2,0
SMD-2.54-6 = smd 0.813 x 1.676: P$1 0,0; P$2 -1.27,0; P$3 -2.54,0; P$4 -3.81,0; P$5 -5.08,0; P$6 -6.35,0; P$7 -6.35,-7.62; P$8 -5.08,-7.62; P$9 -3.81,-7.62; P$10 -2.54,-7.62; P$11 -1.27,-7.62; P$12 0,-7.62
SOT23 = smd 0.95 x 1.4: P$1 -0.95,0; P$2 0.95,0; P$3 0,2.2
RCL_SOT23 = smd 1 x 1.4: 1 -0.95,-1.1; 2 0.95,-1.1; 3 0,1.1
SOIC-8E = smd 0.61 x 1.905: 1 -1.905,-3.048; 2 -0.635,-3.048; 3 0.635,-3.048; 4 1.905,-3.048; 5 1.905,3.048; 6 0.635,3.048; 7 -0.635,3.048; 8 -1.905,3.048 | smd 3.505 x 2.616: EXP 0,0
SOT95P255X145-3N = smd 0.559 x 1.321: 1 -0.94,-1.194; 2 0.94,-1.194; 3 0,1.194
TQFP-64A-64 = smd 1.194 x 0.559: 1 -7.8,6; 2 -7.8,5.2; 3 -7.8,4.4; 4 -7.8,3.6; 5 -7.8,2.8; 6 -7.8,2; 7 -7.8,1.2; 8 -7.8,0.4; 9 -7.8,-0.4; 10 -7.8,-1.2; 11 -7.8,-2; 12 -7.8,-2.8; 13 -7.8,-3.6; 14 -7.8,-4.4; 15 -7.8,-5.2; 16 -7.8,-6; 33 7.8,-6; 34 7.8,-5.2; 35 7.8,-4.4; 36 7.8,-3.6; 37 7.8,-2.8; 38 7.8,-2; 39 7.8,-1.2; 40 7.8,-0.4; 41 7.8,0.4; 42 7.8,1.2; 43 7.8,2; 44 7.8,2.8; 45 7.8,3.6; 46 7.8,4.4; 47 7.8,5.2; 48 7.8,6 | smd 0.559 x 1.194: 17 -6,-7.8; 18 -5.2,-7.8; 19 -4.4,-7.8; 20 -3.6,-7.8; 21 -2.8,-7.8; 22 -2,-7.8; 23 -1.2,-7.8; 24 -0.4,-7.8; 25 0.4,-7.8; 26 1.2,-7.8; 27 2,-7.8; 28 2.8,-7.8; 29 3.6,-7.8; 30 4.4,-7.8; 31 5.2,-7.8; 32 6,-7.8; 49 6,7.8; 50 5.2,7.8; 51 4.4,7.8; 52 3.6,7.8; 53 2.8,7.8; 54 2,7.8; 55 1.2,7.8; 56 0.4,7.8; 57 -0.4,7.8; 58 -1.2,7.8; 59 -2,7.8; 60 -2.8,7.8; 61 -3.6,7.8; 62 -4.4,7.8; 63 -5.2,7.8; 64 -6,7.8
SOIC127P600X175-8N = smd 1.981 x 0.533: 1 -2.464,1.905; 2 -2.464,0.635; 3 -2.464,-0.635; 4 -2.464,-1.905; 5 2.464,-1.905; 6 2.464,-0.635; 7 2.464,0.635; 8 2.464,1.905
SOT95P237X112-3N = smd 1.321 x 0.559: 1 -1.092,0.94; 2 -1.092,-0.94; 3 1.092,0
DFN12 = smd 0.7 x 0.25: 1 -1.35,1.125; 2 -1.35,0.675; 3 -1.35,0.225; 4 -1.35,-0.225; 5 -1.35,-0.675; 6 -1.35,-1.125; 7 1.35,-1.125; 8 1.35,-0.675; 9 1.35,-0.225; 10 1.35,0.225; 11 1.35,0.675; 12 1.35,1.125 | smd 1.6 x 2.5: 13 0,0
QFN-26 = smd 0.9 x 0.25: 1 -2.35,1.75; 2 -2.35,1.25; 3 -2.35,0.75; 4 -2.35,0.25; 5 -2.35,-0.25; 6 -2.35,-0.75; 7 -2.35,-1.25; 8 -2.35,-1.75; 14 2.35,-1.75; 15 2.35,-1.25; 16 2.35,-0.75; 17 2.35,-0.25; 18 2.35,0.25; 19 2.35,0.75; 20 2.35,1.25; 21 2.35,1.75 | smd 0.3 x 2.5: 9 -1.4,-1.55; 10 -0.7,-1.55; 11 0,-1.55; 12 0.7,-1.55; 13 1.4,-1.55; 22 1.4,1.55; 23 0.7,1.55; 24 0,1.55; 25 -0.7,1.55; 26 -1.4,1.55
SOT95P237X112-3N' = smd 1.321 x 0.559: 1 -1.092,0.94; 2 -1.092,-0.94 | smd 1.321 x 0.508: 3 1.092,0
8HSOIC = smd 0.5 x 2: 1 -1.905,-3; 2 -0.635,-3; 3 0.635,-3; 4 1.905,-3; 5 1.905,3; 6 0.635,3; 7 -0.635,3; 8 -1.905,3 | smd 3.1 x 2.4: EP 0,0
SOT95P280X145-5N = smd 1.27 x 0.559: 1 -1.295,0.94; 2 -1.295,0; 3 -1.295,-0.94; 4 1.295,-0.94; 5 1.295,0.94
USB-B-PTH = drill 0.914 pad 1.676: D+ 0,1.25; D- 1.981,1.25; GND 0,-1.25; VBUS 1.981,-1.25 | drill 2.286: S1 -2.718,-6.02; S2 -2.718,6.02
6410-04 = drill 1.016 long: 1 3.81,0; 2 1.27,0; 3 -1.27,0; 4 -3.81,0

### Placement (x,y rotation side)
5VOUT  57,6 90 top
+5V  48.7,2.4 180 top
C1  56,35 180 top
C2  56,27 180 top
C3  3,9 270 top
C4  22,7 90 top
C5  34,12 270 top
C6  9,26.3 270 top
C7  46.7,7 90 top
C8  28,6 0 top
C9  49,14.7 90 top
C10  52,18 0 top
C11  9,30 270 top
C12  10,20 0 top
C13  41.6,49.7 0 top
C14  66,24 0 top
C15  41.6,41.7 180 top
C16  38.5,43 90 top
C17  36.3,43 90 top
C18  32,37 180 top
C19  37.9,47.6 180 top
C20  8.8,33.3 180 top
C21  32,34.9 180 top
C22  32,32.8 180 top
C23  32,30.7 180 top
C24  65.6,60 270 top
C25  85,46 270 top
C26  21,20 180 top
C27  11.2,14 180 top
C28  93,39 270 top
C29  33.2,46.9 90 top
C30  44.8,19 90 top
C31  83,16 270 top
C32  89,16 270 top
C33  32,26.5 0 top
C34  48.1,43 270 top
C40  57,52 270 top
C41  52,55 0 top
C43  93.2,44.49 270 top
C44  83,51 0 top
C45  82,43.7 180 top
D1  28,3 180 top
DC  52,60 180 top
DIAG  35,63 270 top
DOOR  67.9,63.93 180 top
F1  51.28,7.06 270 top
F2  64,3 270 top
FB1  77,56 180 top
HOME  86,3.94 0 top
HOME1  86,10 0 top
J2  68.16,32.02 180 top
L1  38,5 0 top
L3  41.6,43.9 180 top
MOTOR  16.86,57.03 180 top
PDI  42,61 90 top
PTC1  71,18.9 0 top
PTC2  71,21 0 top
PWR  12,4 90 top
PWR1  12,10 90 top
R1  97,9 90 top
R2  21.9,11.6 270 top
R3  36.1,12 90 top
R4  39,12 270 top
R5  41.2,12 90 top
R6  43.4,12 270 top
R7  45.5,2.4 0 top
R9  61,60 270 top
R10  63.3,60 90 top
R11  69,11.2 0 top
R12  69,9 180 top
R13  46,43 270 top
R14  37.3,59 270 top
R15  35,59 270 top
R16  71,16.7 0 top
R17  71,23.2 180 top
R18  31.6,43.9 180 top
R19  28.4,43.9 0 top
R20  41.6,47.6 180 top
R31  87.9,52 270 top
R40  57,47.6 270 top
R41  90.1,52 270 top
R42  93.2,48 270 top
R43  83,53.3 180 top
RN1  29.4,40.4 0 top
RN3  29,59 180 top
RN4  29,51 180 top
RN5  29,55 180 top
RS485  88,29 0 top
RS485*  88,23.7 0 top
S3  64.39,41.53 180 top
SYS  37.3,63 270 top
TVS1  75,20 270 top
TVS2  86,16 0 top
U1  28,10 90 top
U2  52,14.8 180 top
U3  44.36,31.43 0 top
U4  64.25,19.94 0 top
U5  73,10 270 top
U6  82,47 0 top
U7  89,48 0 top
U8  89,39 270 top
U9  15.8,31.04 180 top
U10  AZ431AN-ATRE1  [SOT95P237X112-3N']  37.7,50.5 180 top
U11  53.02,49.03 0 top
U12  30,47 0 top
USBPWR  80,52 90 top
USBUP  85.89,58.34 270 top
WS2813  72.07,3.93 180 top

### Tracks (layer width: path | path; a pad name or v marks a point on that pad's centre or on a via)
485_N  (via drill 0.3)
  Top 0.152: PTC2.2 72.54,21 arc-45 73.25,20.71 73.29,20.66 arc90 74.71,20.66 TVS1.P$1 87.98,20.95 arc90 88.85,21.82 arc45 88.11,23.59 RS485*.P$2 88.11,23.82 arc45 88.85,25.58 88.85,27.74 arc45 88.56,28.45 RS485.P$2 | 89.6,36.5 U8.7 89.64,33.73 v89.6,33.7
  Bottom 0.152: RS485.P$2 88,31.69 arc-45 88.29,32.39 v89.6,33.7
485_P
  Top 0.152: PTC1.2 72.44,18.9 arc45 73.14,19.19 73.29,19.34 arc-90 74.71,19.34 TVS1.P$2 86.23,19.05 arc45 88,19.78 88.53,20.32 arc45 89.15,21.82 arc-45 89.89,23.59 RS485*.P$1 89.89,23.82 arc-45 89.15,25.58 89.15,27.74 arc-45 89.44,28.45 RS485.P$1 90,31.39 arc45 89.71,32.09 88.66,33.14 arc-45 88.36,33.85 U8.6
485DIR
  Top 0.203: U3.27 46.36,21.44 47.7,20.1 59.9,20.1 60,20.2 | U4.3 60.4,19.3 60,19.7 60,20.2 | U4.2 60.38,20.57 60,20.2
485RX
  Top 0.203: U3.28 47.16,21.54 48.1,20.6 59.2,20.6 60.45,21.84 U4.1 61.74,21.8
485TX
  Top 0.203: U3.29 47.96,21.64 48.5,21.1 58.8,21.1 60.7,23 63,23 63.3,22.7 63.3,18.2 63.1,18 61.82,18 U4.4
!FAULT
  Top 0.152: U9.1 20.6,29.29 arc-45 21.3,29 28.11,22.19 arc45 28.81,21.9 32.89,21.9 arc-45 33.59,21.61 34.91,20.29 arc45 35.61,20 40.19,20 arc45 40.89,20.29 42.87,22.27 arc45 43.16,22.97 U3.23
!SLEEP
  Top 0.152: U3.22 42.36,22.97 arc-45 42.07,22.27 40.49,20.69 arc-45 39.79,20.4 36.01,20.4 arc-45 35.31,20.69 33.89,22.11 arc45 33.19,22.4 29.01,22.4 arc-45 28.31,22.69 21.5,29.5 arc45 20.8,29.79 U9.2
+3V3  (via drill 0.35, 0.4, 0.5)
  Top 0.203: 72.15,17 R16.2
  Top 0.254: PDI.2 36.27,54 v36,54 | v73,16.6 71.95,16.6 R16.2 | C14.2 66.85,24.94 71.97,30.06 J2.1
  Top 0.305: C33.2 33.12,26.23 U3.15 43.66,26.23 arc-45 44.36,25.94 44.65,25.65 44.76,25.54 | 50,35 52.13,35 U3.45 52.19,35 C1.2 | 55.12,27.03 C2.2 | 50.03,27.03 50,28 | 66.7,23.85 C14.2 | 66.71,22.99 66.7,23 | v33,49 33,47.95 C29.2 31.48,47.75 U12.5
  Top 0.406: U3.53 47.16,36.25 arc45 47.45,35.55 47.71,35.29 arc45 48.41,35 50,35 | R13.2 44.85,42.15 43.1,43.9 L3.1 42.45,45.55 42,46 40.8,46 | 40.8,46 v40,46 | R20.2 40.75,46.05 40.8,46
  Top 0.508: C30.2 44.76,20.09 U3.25 44.76,25.54 | 55.12,27.03 U3.35 50.03,27.03 | U3.53 47.16,42.06 47.25,42.15 | C34.2 47.25,42.15 | R13.2 47.25,42.15 | C2.2 55.15,25.85 56,25 62,25 64,23 66.7,23 66.7,23.85 | v68.2,22.8 arc-45 67.94,22.91 C14.2 arc45 66.71,23.67 U4.8
  Top 0.61: 44.65,25.65 45.53,26.3 arc-36 46.13,26.5 49,26.5 arc90 50,27.5 50,28 50,35
  Top 0.813: U2.2 51.06,17.91 C10.1 47.4,18 45.55,19.85 C30.2
  Bottom 0.254: v36,54 33,51 v33,49 | v73,16.6 73,17
  Bottom 0.305: v40,46 38,46 35,49 v33,49
  Bottom 0.406: 75,17 76,17 HOME1.P$4
  Bottom 0.508: v68.2,22.8 68.2,17.8 69,17 73,17 75,17
+5V  (via drill 0.4)  (1 unrouted)
  Top 0.203: 45.15,4.85 46,5 | R7.1 44.65,4.95 | L1.2 42.05,7.35 39,10.4 R4.2 | RN3.4 27.7,59.77 27.48,59.8
  Top 0.254: RN3.2 29.4,60.1 arc90 28.5,61 | 28.5,61 arc90 27.7,60.2 27.7,59.77 | 28.5,61 28.6,60.9 RN3.3 | 26,55.51 26,58.8 arc-90 27,59.8 27.48,59.8
  Top 0.305: v1.6,54.9 1.6,16.44 arc45 2.33,14.67 6.27,10.73 arc-45 7,8.96 7,2 arc90 8,1 40.59,1 arc45 41.29,1.29 41.76,1.76 arc45 42.05,2.46 L1.2 | MOTOR.8 23.15,52.15 25.71,54.71 arc45 26,55.51 25.89,55.2 v24.8,55.2
  Top 0.508: C7.1 46.08,5.52 | 46.24,5.5 arc-45 46.06,5.06 46.01,5.01
  Top 0.813: 49,5.5 C9.1 49,14 49.19,13.61 U2.3 | 44.65,4.95 arc-45 46.01,5.01 | 44.65,4.95 arc45 46.08,5.52 | 44.65,4.95 arc-45 46.01,5.01 | 46.01,5.01 46,5
  Top 1.016: F2.2 63.98,1.6 53.4,1.6 51.28,3.72 F1.2 51.24,5.6 49.02,5.6 C7.1
  Top 1.676: L1.2 46,5
  Bottom 0.305: v1.6,54.9 24.5,54.9 v24.8,55.2
+24V  (via drill 0.4)
  Top 0.254: DOOR.P$1 DOOR.P$2 71.9,64.1 71,65 60,65 57.5,62.5
  Top 0.305: v10.4,28.5 9.35,28.5 C11.2
  Top 0.813: U11.5 55.55,52.66 arc-45 56.26,52.95 C40.1 57.71,53.66 arc45 58,54.36 58,61.59 arc45 57.71,62.29 57.5,62.5 54.29,65.71 arc45 53.59,66 11.41,66 arc45 10.71,65.71 3.29,58.29 arc45 3,57.59 3,25 arc90 4,24 v10.4,24 13,24 13,22
  Top 0.914: U1.7 23.66,9.37
  Top 1.016: 14.1,8 14.1,8.4 C4.2 21.7,8.4 23.66,9.37
  Bottom 0.305: v10.4,28.5 v10.4,24
  pour Top (isolate 0.254, no thermals): 15,30 15,28 14,27 12,25 12,3 arc90 13,2 19,2 arc90 20,3 20,25 17,28 16.7,28.3 16.7,29.9 16.7,30
A
  Top 0.305: U9.26 U9.9 17.2,33.2 18,34
  pour Top (isolate 0.254, no thermals): 17.2,32 17.4,32 17.4,33.4 20.4,33.4 arc90 21.4,34.4 21.4,58 arc90 20.4,59 18.2,59 arc90 17.2,58
  pour Top (isolate 0.254, no thermals): 17.3,28.9 20.4,28.9 21.8,27.5 21.8,26 19.8,26 17.3,28.5
B
  Top 0.305: U9.24 U9.11 15.8,34.8 16,35
  pour Top (isolate 0.254, no thermals): 15.7,32.5 15.9,32.5 15.9,34.2 16.35,34.2 arc90 16.6,34.45 16.6,58 arc90 15.6,59 13,59 arc90 12,58 12,39.91 arc45 12.29,39.21 14.71,36.79 arc-45 15,36.09 15,34.45 arc90 15.25,34.2 15.7,34.2
C
  Top 0.305: U9.22 U9.13 14.4,33.6 14,34
  pour Top (isolate 0.254, no thermals): 14.4,32 14.4,35.89 arc45 14.11,36.59 11.69,39.01 arc-45 11.4,39.71 11.4,58 arc90 10.4,59 7,59 arc90 6,58 6,36 arc90 7,35 9.55,35 arc-58 10.39,34.53 10.81,33.87 arc58 11.65,33.4 14.2,33.4 14.2,32
  pour Top (isolate 0.254, no thermals): 13.5,28.8 14.3,28.8 14.3,28.1 11.9,25.7 11.9,27.2
DOOR_SIG  (via drill 0.3)
  Top 0.203: 61,59 60,58 60,47 55,42 v55,39
  Top 0.254: C24.2 R10.1 R9.2 61,59 | v52,38.4 52,37.59 U3.48
  Bottom 0.254: v55,39 52.6,39 v52,38.4
ENA
  Top 0.152: U3.21 41.56,22.87 arc-45 41.27,22.17 40.19,21.09 arc-45 39.49,20.8 36.41,20.8 arc-45 35.71,21.09 34.19,22.61 arc45 33.49,22.9 29.21,22.9 arc-45 28.51,23.19 21.7,30 arc45 21,30.29 U9.3
ENB
  Top 0.152: U3.20 40.76,22.97 arc-45 40.47,22.27 39.69,21.49 arc-45 38.99,21.2 36.81,21.2 arc-45 36.11,21.49 34.49,23.11 arc45 33.79,23.4 29.31,23.4 arc-45 28.61,23.69 21.8,30.5 arc45 21.1,30.79 U9.4
ENC
  Top 0.152: U3.19 39.96,22.87 arc-45 39.67,22.17 39.39,21.89 arc-45 38.69,21.6 37.21,21.6 arc-45 36.51,21.89 34.79,23.61 arc45 34.09,23.9 29.51,23.9 arc-45 28.81,24.19 22,31 arc45 21.3,31.29 U9.5
GEAR0  (via drill 0.35)
  Top 0.203: v56.4,19 56.4,18.6 62,13 85.05,13
  Top 0.254: HOME.1 82.19,4.19 85,7 HOME1.P$3 85.05,10.05 85.05,13 TVS2.1 | U3.30 48.76,22.34 49.3,21.8 v55.8,21.8
  Top 0.305: C31.2 84.45,15.15 arc-45 TVS2.1
  Bottom 0.254: v55.8,21.8 56.4,21.2 v56.4,19
GEAR1  (via drill 0.3, 0.35)
  Top 0.203: U3.31 49.56,22.74 49.9,22.4 55,22.4 55.2,22.6 56.4,22.6 v57,22 | v57.7,19.3 57.7,18.3 62.3,13.7 80.7,13.7 v81,14
  Top 0.254: HOME.2 84.73,5.73 87,8 HOME1.P$2 86.95,10.05 TVS2.2
  Top 0.305: C32.2 87.55,15.15 arc45 TVS2.2
  Bottom 0.203: v57,22 57,20 v57.7,19.3 | v81,14 83,14 HOME1.P$2
GND  (via drill 0.3, 0.4, 0.5, 0.6, 1, 2.2 pad 5)
  Top 0.203: U9.12 v15.1,31.4 | U9.10 v16.5,31.4 | RN3.1 30.55,59.75 arc-90 v31.3,59 arc-90 30.55,58.25 RN3.8 | RN5.4 26.95,55.75 v26.7,55.8 26.7,55.25 arc90 27.7,54.25 RN5.5
  Top 0.254: U9.18 11.01,30.79 v10.7,31.1 | DIAG.C SYS.C 40.52,63.75 PDI.6 | 41.6,39.19 U3.60
  Top 0.305: R10.2 C24.1 67.55,60.85 67.9,61.2 DOOR.P$4 | 41.6,39.19 41.6,38.6 41,38
  Top 0.406: U11.7 52.38,50.38 | U11.1 51.12,47.12
  Top 0.813: v80,20 TVS1.P$3 | v5,10 3.15,10 C3.1
  Top 1.016: v81,20 v80,20 | FB1.2 74.05,58 v71,58 | v22.5,40.5 v22.5,33.5 22.8,33.5 22.8,40.5 v22.5,40.5
  Top 1.676: v4.6,57.3 4.6,34.4 v5,34
  Bottom 6.35: 6,45 v6,34
  other vias: 15.1,33.7 16.5,33.7 15.1,32.1 16.5,32.1 50.4,50 55.4,50 50.4,49 55.4,49 55.4,48 50.4,48 46,46 36,52 41,52 43,52 57.8,25.9 60.1,25.9 50,25 61,24 57.8,23 26,39.8 23,16 22,2 25,32 35.3,33 35,28 29,27 37,24 43,25 46,25 44.6,26.9 50.9,28 49,28 49,34 49,36 41,37 36,40 26.1,51 33,52.5 46,52 51,43 27,7.3 29,7.3 29,13 27,13 32,13 37.5,13 40,2 50,4 36,2 40,8 36,8 41,10 43,8 47,11 51,11 55,16 61,17 77,12 73,12 95,12 95,7 97,30 98,17 93,2 79,30 75,34 75,40 75,42 75,44 55,38 65,22 63,15 57,14 63,11 33,9 22,3 23,3 23,2 35,16 24,17 22,17 25,22 25,23 68,15 42,20 98,25 77,22 77,18 88,19 87,20 47,17 38,31 15.1,32.8 16.5,32.8 6,33 6,32 7,32 7,31 6,31 5,31 5,32 5,33 5,30 6,30 7,30 7,29 6,29 5,29 5,28 6,28 6,27 5,27 6,26 8,22 9,22 10,22 7,22 6,22 5,22 7,17 10,21 10,20 10,19 9,18 10,18 8,18 7,18 6,18 6,17 8,17 22,24 22,23 22,22 22,25 22.5,37.5 22.5,36.5 22.5,35.5 22.5,34.5 21,25 21,24 21,23 21,22 23,25 23,24 23,23 23,22 7,28 7,27 7,26 9,17 10,17 22,18 23,18 24,18 23,17 22,16 24,16 25,16 25,17 25,18 10.7,22 10.7,21 10.7,20 10.7,19 10.7,18 10.7,17 3,12 29.6,35 29.6,33 29.6,30 22.5,39.5 22.5,38.5 32,42 35,42 29,37 31,47 26,46 37.4,43 41.6,42.8 50.9,34 5,26 36,49 34.5,46 59,52 55,17 46,36 4.6,53.3 25,36 23.2,49.2 24,36 24,37 24,35 24,34 24,33 25,33 25,34 25,35 24,32 25,31 26,30 26,31 26,32 26,33 26,34 26,35 27,34 27,33 27,32 27,31 27,30 27,29 23,26 24,25 24,24 24,23 24,22 33,21 38,19 43,1.3 64,25 84,18
  pour Bottom (isolate 0.305): 1,42 25,42 25,15 13,15 12,14 12,1 1,1
  pour Bottom (isolate 0.203): 15,20 98,20 99,18 99,1 12,1 12,18
  pour Bottom (isolate 0.203): 75,67 2,67 arc90 1,66 1,42 24,42 24,19 76,19 76,66 arc90
  pour Top (isolate 0.254): 49.6,53 60,53 60,45.5 49.6,45.5
  pour Top (isolate 0.254): 21,1 21,24 arc-90 22,25 99,25 99,2 arc-90 98,1
  pour Top (isolate 0.254): 22.8,13 76,13 76,43 arc90 75.64,43.37 48.5,43.37 48.5,53 22.8,53
  pour Bottom (isolate 0.254): 76,31 98,31 arc-90 99,30 99,17 76.25,17 arc-90 76,17.25
  pour Top (isolate 0.254): 76,31 98,31 arc-90 99,30 99,24 76,24
  pour Top (isolate 0.254): 4,34.5 9,34.5 9,25 4,25
  pour Top (isolate 0.305): 2,23 11,23 11,2 7,2 7,9 2,9
H1  (via drill 0.3)
  Top 0.203: RN3.7 29.4,58.21 arc45 29.69,57.51 v30.4,57 30.27,56.92 RN5.1
  Bottom 0.203: MOTOR.6 14.76,52.35 arc-45 15.06,53.06 15.71,53.71 arc-45 16.41,54 26.79,54 arc44 27.58,54.28 v30.4,57
H1_3V3  (via drill 0.3)
  Top 0.203: RN5.8 30.27,53 | 30.27,53 RN4.1 | 33.12,34.63 C21.1 | C21.1 32.85,35 | v26.7,48.7 25.1,47.1 25.1,38.9 28,36 32,36 33,35 | v31,53 30.27,53 | 33,35 32.95,35 C21.1 | U3.2 35.63,36.63 34,35 33,35
  Bottom 0.203: v26.7,48.7 v31,53
H2  (via drill 0.3)
  Top 0.203: RN3.6 28.6,58.01 arc45 28.89,57.31 v29.2,57 29.4,56.8 RN5.2
  Bottom 0.203: MOTOR.5 10.57,52.1 arc-90 11.57,53.1 13.59,53.1 arc45 14.29,53.39 15.01,54.11 arc-45 15.71,54.4 26.59,54.4 arc45 27.29,54.69 28.92,56.32 arc45 v29.2,57
H2_3V3  (via drill 0.3)
  Top 0.203: RN4.2 v29.4,53 RN5.7 | 32.9,32.9 32.9,32.8 C22.1 | 25.79,49.19 24.6,48 24.6,38.7 29.4,33.9 31.75,33.9 C22.1 | U3.3 35.73,35.83 33.9,34 33.9,33.2 33.5,32.8 C22.1
  Top 0.254: v26,49.3 25.9,49.3 25.79,49.19
  Bottom 0.203: v26,49.3 29.4,52.7 v29.4,53
H3  (via drill 0.3)
  Top 0.203: RN5.3 28.6,56.23 arc90 27.8,57.03 27.73,57.1 | RN3.5 27.73,57.1 | v27.5,57 27.62,57 27.73,57.1
  Bottom 0.203: MOTOR.4 27.47,57.03 v27.5,57
H3_3V3
  Top 0.203: RN5.6 28.6,53 | 28.6,53 RN4.3 | 32.9,30.7 33.11,30.7 | C23.1 32.9,30.7 | 32.9,30.7 32.9,30.8 | 28.6,53 27,53 25,51 25,49.4 24.1,48.5 24.1,38.3 28.3,34.1 28.3,32.1 28.8,31.6 31.95,31.6 C23.1 | U3.4 35.83,35.03 34.5,33.7 34.5,31.4 33.8,30.7 C23.1
M1_IN1  (via drill 0.35)
  Top 0.203: U3.46 53,35.83 arc90 54,36.83 54,38.19 arc45 53.71,38.89 53.49,39.11 arc-45 53.2,39.81 53.2,44.39 arc-45 53.49,45.09 53.5,45.1 53.5,45.88 U11.3 53.6,45.98
  Top 0.254: v50.67,35.81 52.14,35.81 U3.46 | 5VOUT.2 58.96,6 60.2,7.24 v60.2,12.06
  Bottom 0.254: v50.67,35.81 58.8,27.69 58.8,24.38 60.2,22.99 v60.2,12.06
M1_IN2
  Top 0.203: U3.47 52.5,36.63 arc90 53.5,37.63 53.5,37.89 arc45 53.21,38.59 52.99,38.81 arc-45 52.7,39.51 52.7,44.62 arc45 52.5,45.1 52.5,45.91 U11.2
M1_OUT1
  Top 0.813: DC.4 53.14,59.64 arc45 52.85,58.94 C41.2 53.36,54.49 arc-45 53.66,53.78 U11.6
M1_OUT2
  Top 0.813: DC.3 50.86,59.64 arc-45 51.15,58.94 C41.1 51.12,54.97 U11.8
MOUNT_H1  (via drill 0.3, 3.2 pad 5.6)
  Top 0.254: v95,5 96.8,5 | 96.8,5 v98,5 v99,5 v99,4 v99,3 v99,2 v99,1 v98,1 v97,1 v96,1 v95,1 v95,2 | 96.8,5 v96.8,3.2
  Top 0.813: R1.1 97,3.4 v96.8,3.2
MOUNT_H2  (via drill 0.4, 3.2 pad 5.6)
  Top 0.254: v5,2 v5,1 v4,1 v3,1 v2,1 v1,1 v1,2 v1,3 v1,4 v1,5 v2,5 3.2,3.8 | 3.2,3.8 v3.2,3.2 | v5,5 3.8,3.8 3.2,3.8
  Top 0.813: C3.2 3,3.4 v3.2,3.2
N$1
  Top 0.508: U1.1 31.05,7.55 | C8.2 31.05,6
  Top 1.524: L1.1 31,5 | 31,5 30.5,5 30.05,4.55 D1.C | 31.05,7.55 31.05,6 31.05,5.05 31,5
N$2
  Top 1.016: F1.1 56.94,8.48 5VOUT.1
N$3
  Top 0.203: C5.1 R3.2
N$4
  Top 0.203: U1.6 22.02,10.63 R2.2
N$5
  Top 0.203: U1.3 33.48,10.63 C5.2
N$6
  Top 0.203: R5.1 R6.2
N$7
  Top 0.203: R5.2 R4.1 39,14 38,15 32,15 31,14 31,11.95 U1.4
N$8
  Top 0.508: C8.1 26,6 25,7 25,7.8 25,8.05 U1.8
N$9
  Top 0.203: R7.2 +5V.A
N$10
  Top 0.203: U4.7 69.62,20.57 PTC2.1 70.05,23.1 R17.2
N$11
  Top 0.254: R18.2 R19.2 29,44.15 arc-45 28.7,44.86 U12.3
N$12
  Top 0.254: U9.20 12.79,29.79 10,27 9.15,27 C6.1
N$13
  Top 0.254: U9.21 13.29,29.29 9.15,25.15 C6.2
N$14
  Top 0.254: U9.19 9.66,30.29 C11.1
N$15
  Top 0.254: 9.45,33.2 C20.1 9.55,33.6 11.89,33.6 arc-45 12.59,33.31 13.11,32.79 U9.14
N$16  (via drill 0.35)
  other vias: 66.55,38.23
N$17
  Top 0.203: U4.6 69.64,19.3 PTC1.1 70.15,18.8 R16.1
N$19
  Top 0.305: L3.2 C15.2 U3.61
N$20  (via drill 0.3)
  Top 0.152: R14.2 37.3,56.2 35,54 v35,48
  Top 0.203: v43.1,37.9 43.16,37.96 U3.58
  Bottom 0.152: v35,48 43,40 43,38
  Bottom 0.203: 43,38 v43.1,37.9
N$21
  Top 0.152: SYS.A R14.1
N$22  (via drill 0.3)
  Top 0.152: R15.2 35,54.9 34.3,54.2 34.3,47.7 v35,47
  Top 0.203: v42.1,37.9 42.36,38.16 U3.59
  Bottom 0.152: v35,47 42,40 42,38
  Bottom 0.203: 42,38 v42.1,37.9
N$23
  Top 0.152: DIAG.A R15.1
N$25  (via drill 3.2 pad 6)
  other vias: 3.2,64.8
N$27  (via drill 3.2 pad 6)
  other vias: 96.8,64.8
N$39
  Top 0.203: R31.2 87.9,49.27 U7.1
N$53
  Top 0.254: R11.2 69.85,11.15 71,10 72.85,10 U5.1
N$60
  Top 0.203: R41.2 90.1,49.27 U7.12
N$62
  Top 0.305: U11.4 56.28,46.03 R40.2
N$63  (via drill 0.3)
  Top 0.254: U7.9 90.92,47.77 91.3,47.4 92,47.4 | 92,47.4 92.75,47.4 R42.2 | v92,47.3 92,47.4 | U7.3 86.33,48.23 v86.2,48
  Top 0.305: R42.2 C43.1
  Bottom 0.254: v86.2,48 86.8,47.4 89.1,47.4 90.8,45.7 91.8,45.7 92.1,46 92.1,47.2 v92,47.3
N$64  (via drill 0.3)
  Top 0.203: U7.2 87.12,48.67 v86.6,49.4 | R42.1 92.25,48.85 v92,49.1
  Bottom 0.203: v92,49.1 91.7,49.4 v86.6,49.4
N$65  (via drill 0.3)
  Top 0.203: U7.7 90.35,44.35 v90.1,44 | v87.1,43.4 U8.4
  Bottom 0.203: v90.1,44 87.7,44 v87.1,43.4
N$66  (via drill 0.3)
  Top 0.203: v91.3,46.5 91.3,42.56 U8.1 | U7.10 91.28,48.23 v91.3,48.3
  Bottom 0.203: v91.3,48.3 v91.3,46.5
N$67
  Top 0.203: U7.6 87.65,44.85 89,43.5 | 89,43.5 88.4,42.8 88.4,41.5 U8.3 | U8.2 89.64,42.87 89,43.5
N$68
  Top 0.203: USBPWR.A 81.6,52.75 R43.2
PDI_CLK  (via drill 0.3)
  Top 0.152: U3.57 43.96,40.16 v44.7,40.9 | PDI.5 43.27,63.03 44.6,61.7 44.6,45.4 45,45 45,43.8 v44.7,43.7
  Top 0.203: v44.7,43.7 44.8,43.8 45,43.8 45.95,43.8 R13.1
  Bottom 0.152: v44.7,40.9 v44.7,43.7
PDI_DATA  (via drill 0.3)
  Top 0.152: v44.6,37.9 44.76,38.06 U3.56 | PDI.1 43.44,58.46 44.2,57.7 44.2,45.2 v44,45
  Bottom 0.152: v44,45 44,38.5 v44.6,37.9
PE7
  Top 0.203: U3.43 57.69,33.43 60.45,36.2 60.45,41.27 65.02,45.85 70.1,45.85 70.74,46.48 S3.P$7
PF3  (via drill 0.3, 0.35)
  Top 0.203: U3.49 50.36,37.94 v50.5,37.8 | v69.34,47.12 69.47,47.24 S3.P$8
  Bottom 0.203: v50.5,37.8 50.5,39.1 51.1,39.7 57.5,39.7 59.69,41.89 59.69,41.91 62.73,44.96 67.18,44.96 v69.34,47.12
PF4  (via drill 0.3, 0.35)
  Top 0.203: U3.50 49.56,37.84 v49.6,37.8 | v67.94,47.24 68.2,47.5 S3.P$9
  Bottom 0.203: v49.6,37.8 49.6,39.4 50.4,40.2 57.47,40.2 62.74,45.47 66.17,45.47 v67.94,47.24
PF5  (via drill 0.3, 0.35)
  Top 0.203: U3.51 48.76,38.04 v48.6,37.8 | v66.67,47.12 66.93,47.37 S3.P$10
  Bottom 0.203: v48.6,37.8 48.8,38 48.8,39.4 50.1,40.7 57.46,40.7 62.74,45.97 65.53,45.97 v66.67,47.12
PF6  (via drill 0.3, 0.35)
  Top 0.203: U3.54 46.36,37.26 v46.3,37.2 | v65.41,47.12 65.66,47.37 S3.P$11
  Bottom 0.203: v46.3,37.2 46.3,39.7 47.9,41.3 57.56,41.3 63.37,47.12 v65.41,47.12
PF7  (via drill 0.3, 0.35)
  Top 0.203: U3.55 45.56,37.46 v45.3,37.2 | v62.74,49.15 S3.P$12
  Bottom 0.203: v45.3,37.2 45.3,39.6 47.6,41.9 57.52,41.9 62.74,47.12 v62.74,49.15
PWMA
  Top 0.152: U3.18 39.16,23.1 arc-90 38.16,22.1 37.41,22.1 arc-45 36.71,22.39 34.99,24.11 arc45 34.29,24.4 29.71,24.4 arc-45 29.01,24.69 22.2,31.5 arc45 21.5,31.79 U9.6
PWMB
  Top 0.152: U9.7 21.6,32.29 arc-45 22.3,32 29.11,25.19 arc45 29.81,24.9 34.59,24.9 arc-45 35.29,24.61 36.61,23.29 arc45 37.31,23 37.73,23 arc90 38.3,23.57 U3.17
PWMC
  Top 0.152: U3.16 29.98,25.43 arc-45 29.28,25.72 22.5,32.5 arc45 21.8,32.79 U9.8
SCLK
  Top 0.254: U3.40 56.73,31.03 59.94,27.81 66.93,27.81 69.43,30.31 J2.2
SDA
  Top 0.254: U3.41 57.32,31.83 60.83,28.32 65.02,28.32 66.89,30.19 J2.3
SIG-DOOR
  Top 0.254: DOOR.P$7 61.9,61.75 R9.1
SOA  (via drill 0.3, 0.4)
  Top 0.203: U9.15 12.98,32.29 arc-37 12.68,32.39 v12,32.9 | v29.8,42.3 RN1.6
  Top 0.254: C16.1 38.5,41.61
  Top 0.305: U3.63 39.16,40.31 arc45 v39,40.7 38.79,40.91 arc-45 38.5,41.61
  Bottom 0.203: v12,32.9 11.64,33.32 arc-41 11.4,33.97 11.4,39.99 arc-45 11.69,40.69 14.21,43.3 arc-46 14.93,43.6 28.09,43.6 arc-45 28.79,43.31 v29.8,42.3 29.8,42.1 arc90 30.8,41.1 36.39,41.1 arc45 36.75,41.25 36.75,41.25 arc-45 37.11,41.4 38.09,41.4 arc-45 38.45,41.25 v39,40.7
SOB  (via drill 0.3, 0.4)
  Top 0.203: U9.16 12.98,31.79 arc-45 12.35,32.05 arc45 11.99,32.2 v11.2,32.2 | v28.7,42.3 28.85,42.15 arc-45 29,41.79 RN1.7
  Top 0.254: U3.64 38.36,39.74 | C17.1 36.3,41.8
  Top 0.305: 38.36,39.74 v37.4,40.7 36.3,41.8
  Bottom 0.203: v11.2,32.2 11.25,32.15 11.84,32.15 arc45 12.54,32.44 12.55,32.45 arc45 12.7,32.81 12.7,32.99 arc45 12.55,33.35 12.09,33.81 arc-45 11.8,34.51 11.8,39.59 arc-45 12.09,40.29 14.51,42.71 arc-45 15.21,43 27.59,43 arc-45 28.29,42.71 v28.7,42.3 28.7,42.01 arc45 28.99,41.31 29.31,40.99 arc45 30.01,40.7 v37.4,40.7
  Bottom 0.254: 37.3,40.8 v37.4,40.7
SOC  (via drill 0.3, 0.4)
  Top 0.203: U9.17 12.61,31.29 arc-22 12.23,31.36 v11.9,31.5 | v27.6,42.3 27.6,42.09 arc45 27.89,41.38 RN1.8
  Top 0.305: U3.1 35.17,37.43 arc-45 v35,37.5 34.79,37.29 arc-45 34.09,37 C18.1
  Bottom 0.203: v11.9,31.5 12.2,31.5 12.82,32 arc51 13.2,32.78 13.2,32.89 arc45 12.91,33.59 12.49,34.01 arc-45 12.2,34.71 12.2,39.19 arc-45 12.49,39.89 14.71,42.11 arc-45 15.41,42.4 27.18,42.4 arc-27 v27.6,42.3 27.6,42 30.81,38.79 arc45 31.51,38.5 33.59,38.5 arc-45 34.29,38.21 v35,37.5
SYNC
  Top 0.254: DOOR.P$6 DOOR.P$5
USBDN1_DM
  Top 0.203: USBUP.D- 87.73,56.36 arc-45 88.43,56.07 88.51,55.99 arc-45 88.8,55.29 88.8,54.16 arc-45 88.51,53.46 R31.1
USBDN1_DP
  Top 0.203: USBUP.D+ 87.75,58.34 arc-45 88.45,58.05 88.91,57.59 arc-45 89.2,56.89 89.2,54.16 arc45 89.49,53.46 R41.1
USBGND  (via drill 0.4)
  Top 0.203: U7.13 88.33,47.33 U7.5 87.62,47.3 87.2,47.3 86.9,47
  other vias: 89,46 86.6,46 91,54 86,54 89,45 79,40 85,41 85,37 79,47 84,49 97,47 97,40 97,33 79,33 89,48.6 89,50.3
  pour Top (isolate 0.254): 78,33 78,65 arc-90 79,66 97,66 arc-90 98,65 98,33 arc-90 97,32 79,32 arc-90
  pour Bottom (isolate 0.203): 78,33 78,66 arc-90 79,67 97,67 arc-90 98,66 98,33 arc-90 97,32 79,32 arc-90
VBUS
  Top 0.254: U7.4 87.08,47.77 86.4,47.1 85.25,47.1 C25.1 85,47 84,48 82.19,48 U6.3
  Top 0.61: USBUP.VBUS 84.64,54.09 R43.1 83.85,52.45 83.6,52.2 82.6,52.2 82.15,51.75 C44.1 82,50.85 U6.3
VBUS_3V3
  Top 0.508: C45.1 82.85,41.15 85,39 90,39 91,38 | 91,38 91,36.63 U8.8 | C28.2 91.15,38.15 91,38
  Top 0.813: U6.2 82.94,43.79 C45.1
VREF
  Top 0.254: C19.1 38.75,45.55 | 38.75,45.55 39.41,44.89 arc-45 39.7,44.19 39.7,41.31 arc45 39.85,40.95 39.85,40.95 arc-45 40,40.59 40,39.27 | 38.75,45.55 35.86,45.55 arc45 35.16,45.26 34.09,44.19 arc-45 33.39,43.9 R18.1
  Top 0.305: U10.2 U10.1 | U10.1 38.79,47.64 C19.1 | 40,39.27 U3.62 | R20.1 42.2,47.85 arc90 41.35,48.7 arc-90 40.75,49.3 C13.1 40.61,49.56 U10.1
VREF_1V25  (via drill 0.3)
  Top 0.203: 31.26,46.1 U12.4 | RN1.1 28.12,38.88 28.3,38.7 29,38.7 | 29,38.7 29.6,38.7 29.8,38.9 RN1.3 | RN1.2 29,38.7
  Top 0.254: U12.1 29.76,47.94 30,47.7 30,46.3 30.2,46.1 | 30.2,46.1 31.26,46.1 | 30.2,46.1 v30.2,45.5 | v25.9,44.7 25.9,41 27.1,39.9 27.88,39.9 RN1.1
  Bottom 0.254: v30.2,45.5 26.7,45.5 v25.9,44.7
WS2813+5V
  Top 0.508: R12.2 68.15,4.04 WS2813.1
  Top 0.813: WS2813.1 67.77,4.42 F2.1
WS2813_CTRL
  Top 0.203: U3.26 45.56,21.44 47.4,19.5 54.5,19.5 61.8,12.2 67.15,12.2 R11.1
WS2813_MO
  Top 0.254: R12.1 72.91,9 U5.3 73,4.27 WS2813.3 WS2813.4

### Text on the board
tPlace: Jan 2021 / ver: 0.3 | !EXCHANGE_DRV | 称重 | B | A | 舵机
tStop: C | B | A | works of Marco | fusionRobotics